# Altium project BeagleBone-AI.PrjPcb (part 1 of 5)
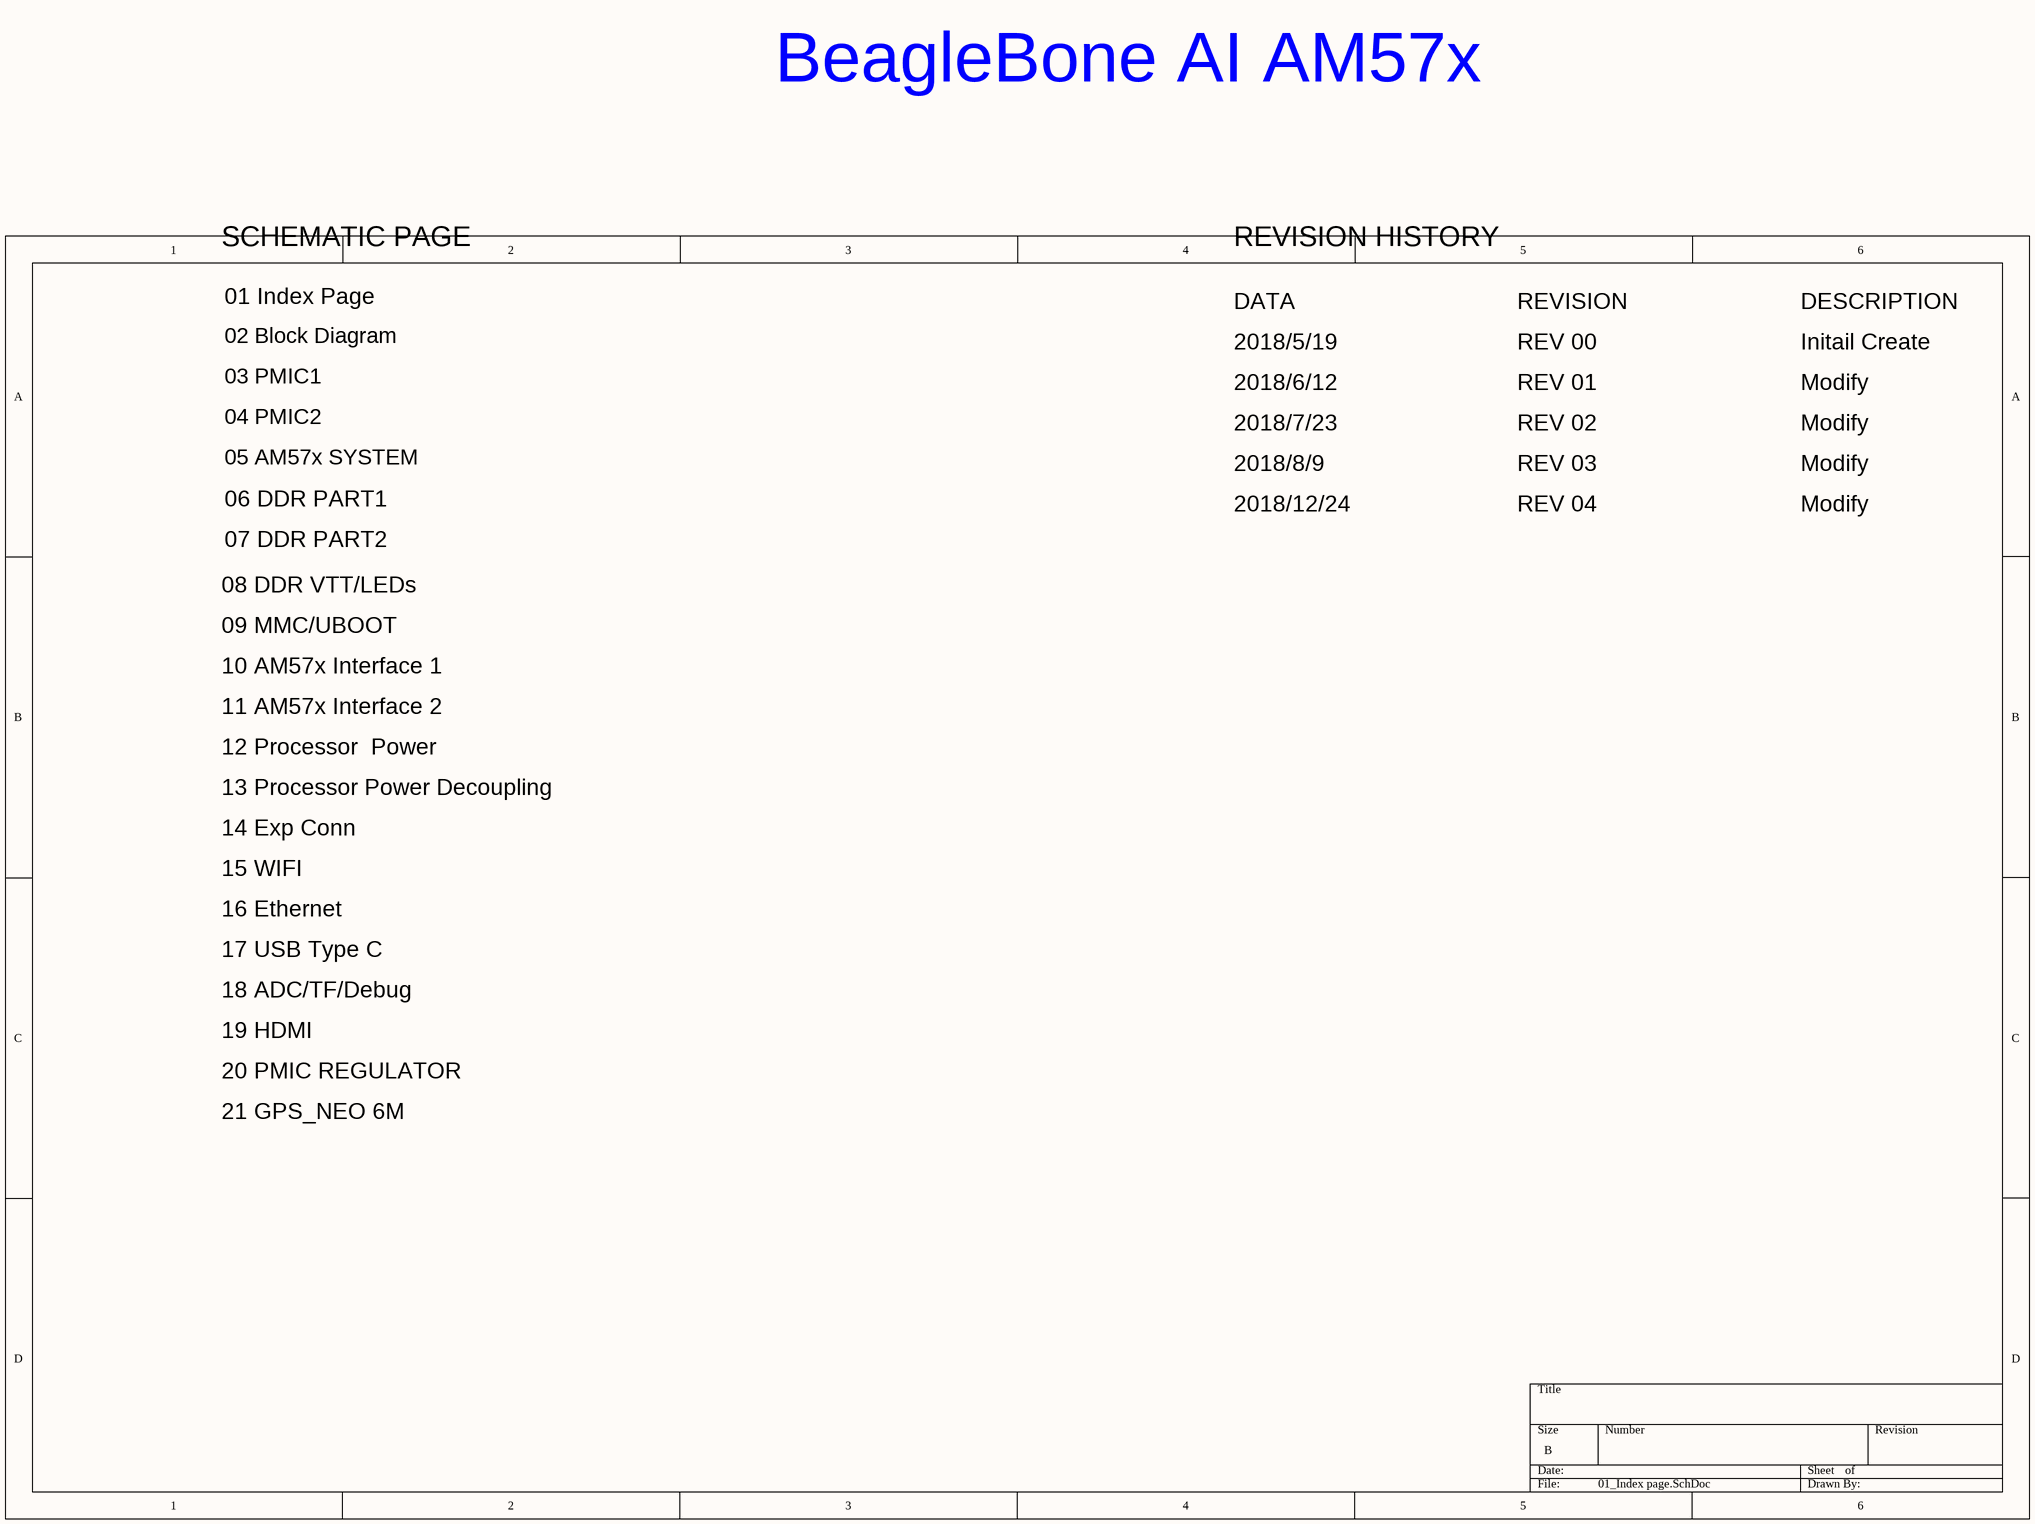
[diagram p0: 01_Index page.SchDoc]
PROJECT NAME: FIT FOR PURPOSE DEVICE; REVISION: V1.0; SIZE: B
22 sheets, 837 parts. Net scope: flat (ports and power ports of the same name join across sheets).
Sheets:
  01_Index page.SchDoc
  02 Block Diagram.SchDoc
  03 PMIC1.SchDoc
  04 PMIC2.SchDoc
  05 AM572x SYSTEM.SchDoc
  06 DDR PART1.SchDoc
  07 DDR PART2.SchDoc
  08 DDR VTT_LEDs.SchDoc
  09 MMC_UBOOT.SchDoc
  10 AM572x Interface 1.SchDoc
  11 AM572x Interface 2.SchDoc
  12 Processor  Power.SchDoc
  13 Processor Power Deco.SchDoc
  14 Exp Conn.SchDoc
  15 WIFI.SchDoc
  16 Ethernet.SchDoc
  17 USB Type C.SchDoc
  18 ADC_TF_Debug.SchDoc
  19 HDMI.SchDoc
  PMIC REGULATORS.SchDoc
  GPS_NEO.SchDoc
  BMS_Circuit.SchDoc

## Sheet 01_Index page.SchDoc: FIT FOR PURPOSE DEVICE
size B; Date: OCTOBER 16, 2020; CompanyName: ICTA; DrawnBy: Researchers; Organization: ICTA; DocumentNumber: 1 OF 21; Revision: V1.0; SheetNumber: 1; SheetTotal: 22; ImagePath: C:\Users\ReaiotV\Desktop

### Notes on the sheet
- BeagleBone AI AM57x
- SCHEMATIC PAGE
- REVISION HISTORY
- 01 Index Page
- DATA
- REVISION
- DESCRIPTION
- 03 PMIC1
- 02 Block Diagram
- 2018/5/19
- 2018/6/12
- REV 00
- REV 01
- Initail Create
- Modify
- 04 PMIC2
- 05 AM57x SYSTEM
- 2018/7/23
- REV 02
- 06 DDR PART1
- 2018/8/9
- 2018/12/24
- REV 03
- REV 04
- 08 DDR VTT/LEDs
- 07 DDR PART2
- 09 MMC/UBOOT
- 10 AM57x Interface 1
- 11 AM57x Interface 2
- 13 Processor Power Decoupling
- 12 Processor  Power
- 14 Exp Conn
- 15 WIFI
- 16 Ethernet
- 17 USB Type C
- 18 ADC/TF/Debug
- 19 HDMI
- 20 PMIC REGULATOR
- 21 GPS_NEO 6M

## Sheet 02 Block Diagram.SchDoc
size 386 x 246 mm

## Sheet 03 PMIC1.SchDoc
size 420 x 297 mm
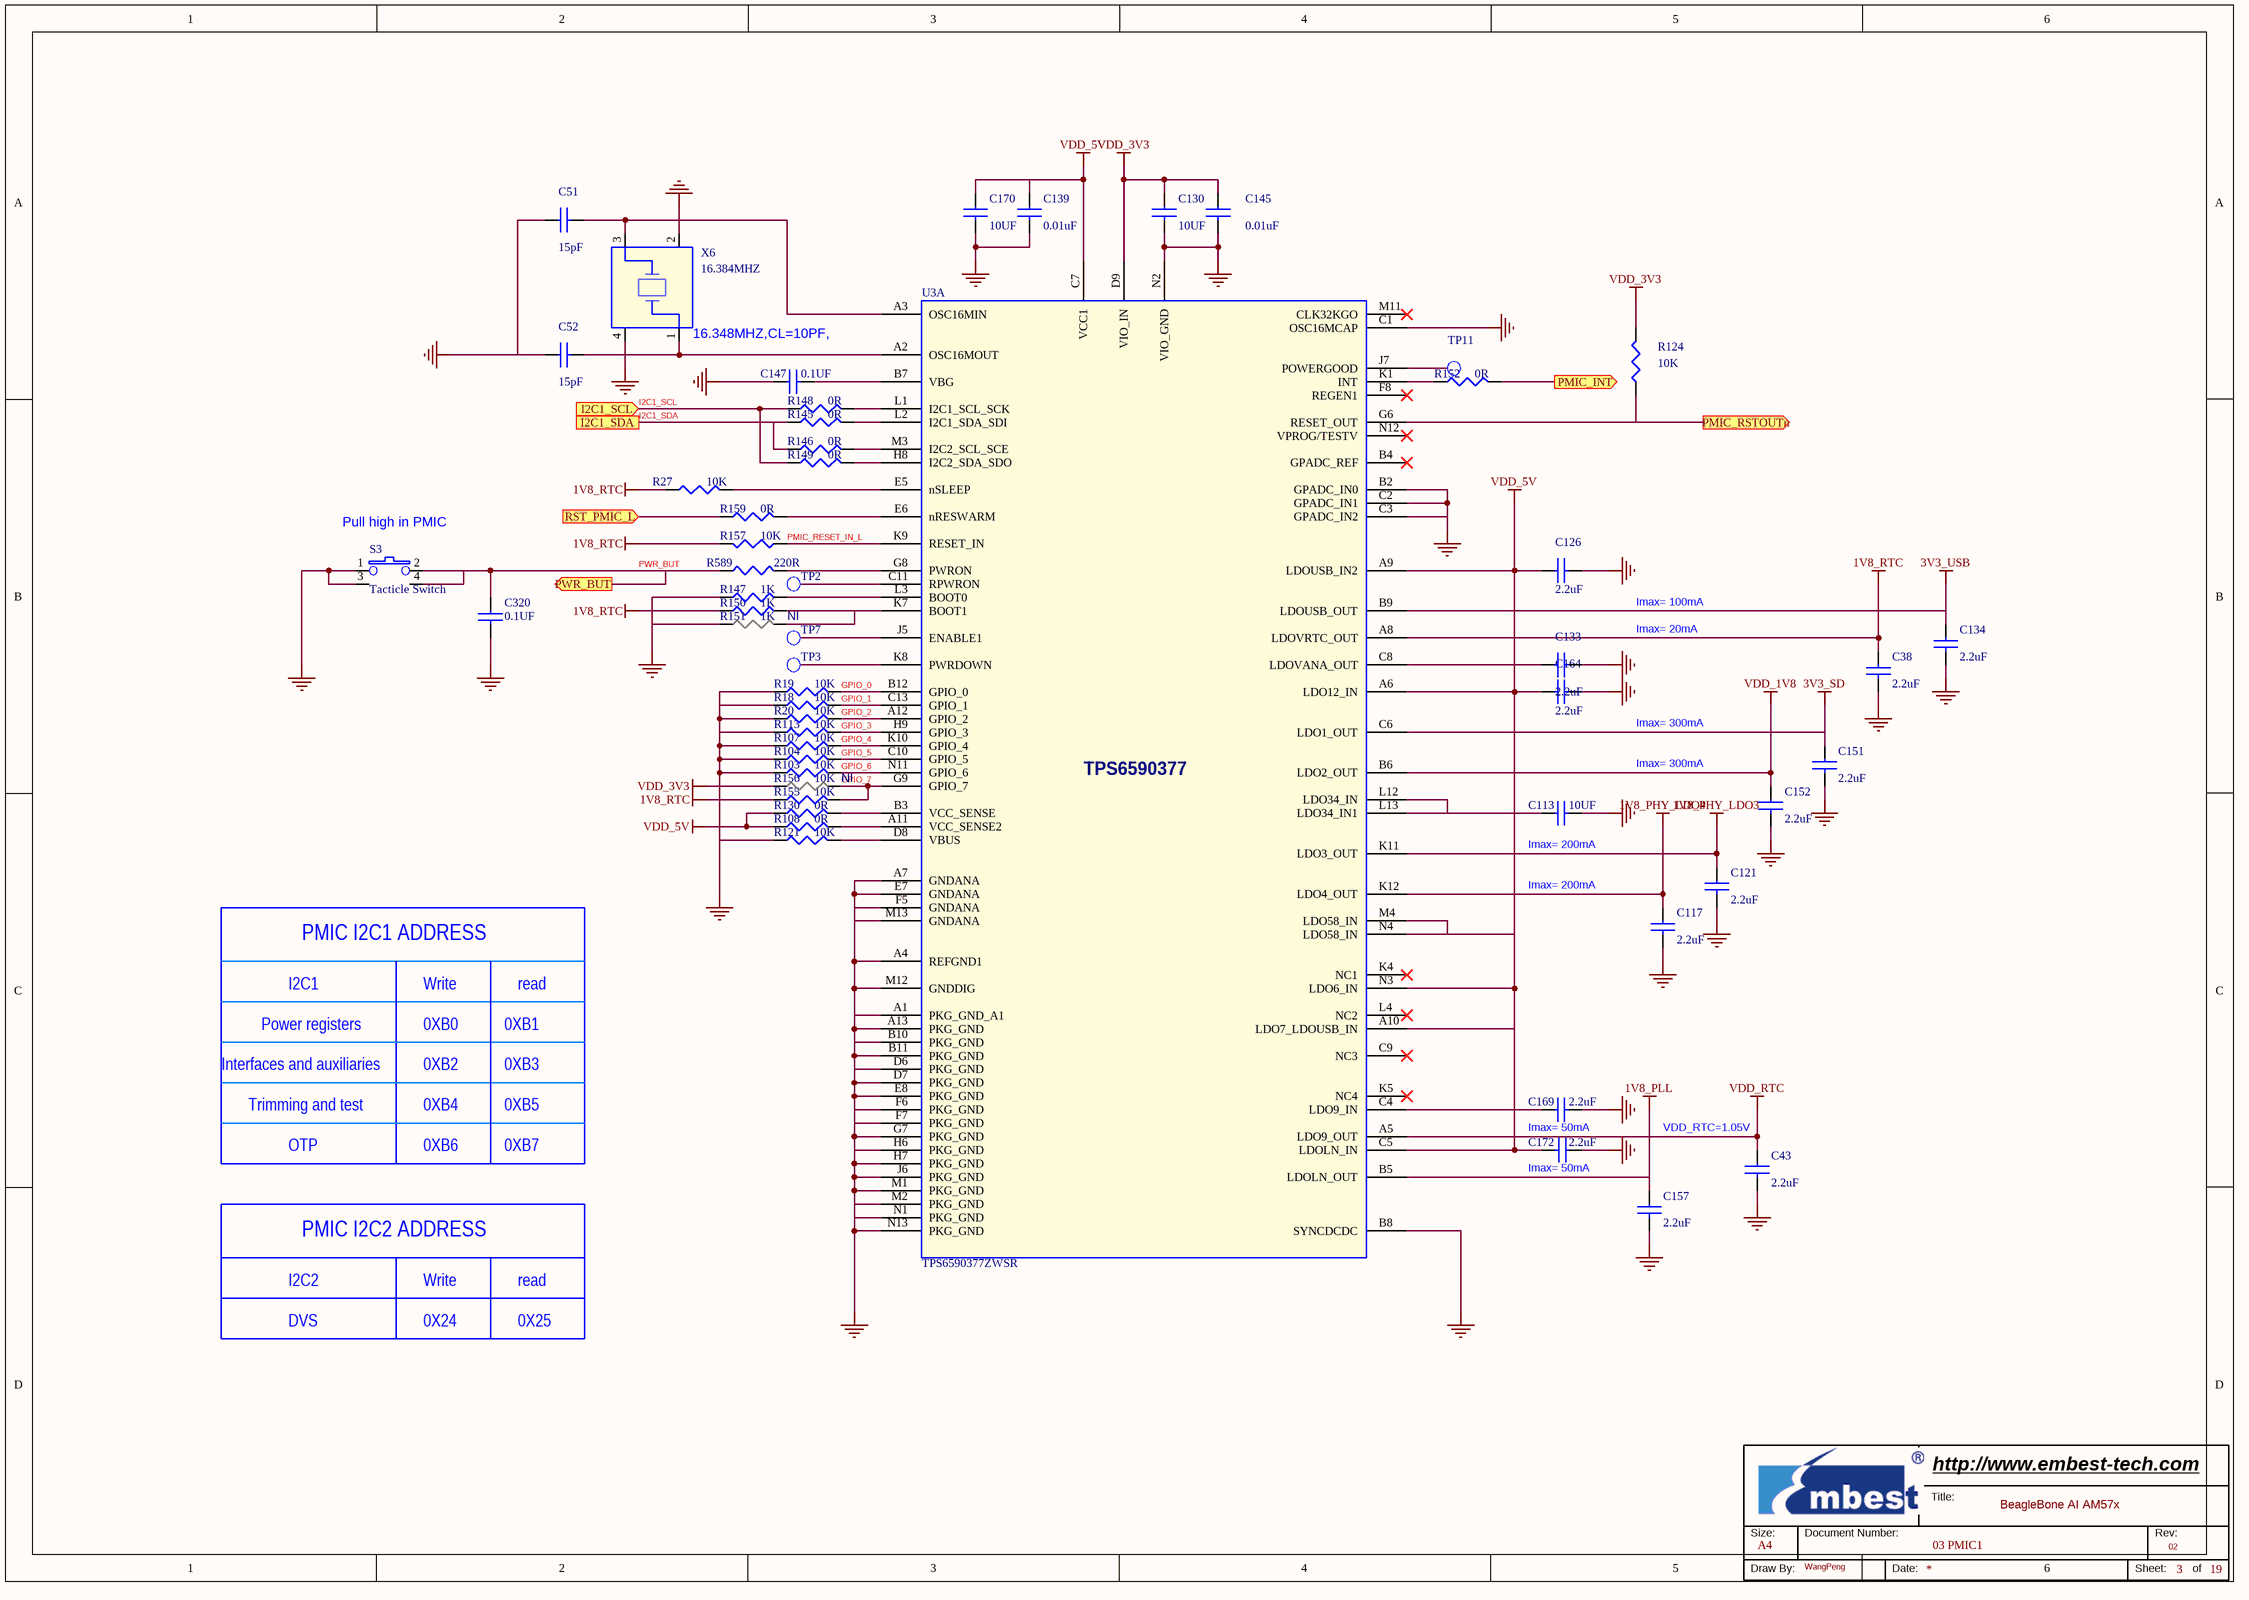
[diagram p1: 03 PMIC1.SchDoc]

### Parts
(Parts that share a designator on the sheet are numbered #1, #2 ... from top to bottom, then left to right.)
*#1  Page Count: 19  Page Number: 3  Page Size: A4  Title: BeagleBone AI AM57x  RevCode: 02  Doc: 03 PMIC1  Drawing: WangPeng  (hidden comment: Embest Title)  (graphical)
C38  2.2uF  [C0402]
C43  2.2uF  [C0402]
C51  15pF  [C0402]
C52  15pF  [C0402]
C113  10UF  [C0603]
C117  2.2uF  [C0402]
C121  2.2uF  [C0402]
C126  2.2uF  [C0603]
C130  10UF  [C0603]
C133  2.2uF  [C0402]
C134  2.2uF  [C0402]
C139  0.01uF  [C0402]
C145  0.01uF  [C0402]
C147  0.1UF  [C0402]
C151  2.2uF  [C0402]
C152  2.2uF  [C0402]
C157  2.2uF  [C0402]
C164  2.2uF  [C0603]
C169  2.2uF  [C0603]
C170  10UF  [C0603]
C172  2.2uF  [C0603]
C320  0.1UF  [C0402]
R18  10K  [R0402]
R19  10K  [R0402]
R20  10K  [R0402]
R27  10K  [R0402]
R103  10K  [R0402]
R104  10K  [R0402]
R107  10K  [R0402]
R108  0R  [R0402]
R113  10K  [R0402]
R121  10K  [R0402]
R124  10K  [R0402]
R130  0R  [R0402]
R145  0R  [R0402]
R146  0R  [R0402]
R147  1K  [R0402]
R148  0R  [R0402]
R149  0R  [R0402]
R150  1K  [R0402]
R151  1K  ASSY: NI  [R0402]
R152  0R  [R0402]
R155  10K  [R0402]
R156  10K  ASSY: NI  [R0402]
R157  10K  [R0402]
R159  0R  [R0402]
R589  220R  [R0402]
S3  Tacticle Switch  [SWS4B46X28]
TP2  NI  [TP1-8040]  (value not drawn)
TP3  NI  [TP1-8040]  (value not drawn)
TP7  NI  [TP1-8040]  (value not drawn)
TP11  NI  [TP1-8040]  (value not drawn)
U3  TPS6590377ZWSR  [bga12x12-169-55m]  (part A of 2)
X6  16.384MHZ  [OSCCC250x200x60-4N]

### Ports
I2C1_SCL (in), I2C1_SDA, PMIC_INT (out), PMIC_RSTOUTn (out), PWR_BUT (out), RST_PMIC_L (in)

### Nets
1V8_PHY_LDO3: C121.1 U3.K11(LDO3_OUT)
1V8_PHY_LDO4: C117.1 U3.K12(LDO4_OUT)
1V8_PLL: C157.1 U3.B5(LDOLN_OUT)
1V8_RTC: C38.1 R27.1 R150.1 R155.1 R157.2 U3.A8(LDOVRTC_OUT)
3V3_SD: C151.1 U3.C6(LDO1_OUT)
3V3_USB: C134.1 U3.B9(LDOUSB_OUT)
GND: C38.2 C43.2 C51.1 C52.1 C113.2 C117.2 C121.2 C126.2 C130.2 C133.2 C134.2 C139.2 C145.2 C147.1 C151.2 C152.2 C157.2 C164.2 C169.2 C170.2 C172.1 C320.2 R18.1 R19.1 R20.1 R103.1 R104.1 R107.1 R113.1 R121.1 R147.1 R151.1 S3.1 S3.3 U3.A1(PKG_GND_A1) U3.A4(REFGND1) U3.A7(GNDANA) U3.A13(PKG_GND) U3.B2(GPADC_IN0) U3.B8(SYNCDCDC) U3.B10(PKG_GND) U3.B11(PKG_GND) U3.C1(OSC16MCAP) U3.C2(GPADC_IN1) U3.C3(GPADC_IN2) U3.D6(PKG_GND) U3.D7(PKG_GND) U3.E7(GNDANA) U3.E8(PKG_GND) U3.F5(GNDANA) U3.F6(PKG_GND) U3.F7(PKG_GND) U3.G7(PKG_GND) U3.H6(PKG_GND) U3.H7(PKG_GND) U3.J6(PKG_GND) U3.M1(PKG_GND) U3.M2(PKG_GND) U3.M12(GNDDIG) U3.M13(GNDANA) U3.N1(PKG_GND) U3.N2(VIO_GND) U3.N13(PKG_GND) X6.2 X6.4  [project net DDR1_RST]
VDD_1V8: C152.1 U3.B6(LDO2_OUT)
VDD_3V3: C130.1 C145.1 R124.2 R156.1 U3.D9(VIO_IN)
VDD_5V: C126.1 C139.1 C164.1 C170.1 C172.2 R108.1 R130.1 U3.A6(LDO12_IN) U3.A9(LDOUSB_IN2) U3.A10(LDO7_LDOUSB_IN) U3.C5(LDOLN_IN) U3.C7(VCC1) U3.M4(LDO58_IN) U3.N3(LDO6_IN) U3.N4(LDO58_IN)
VDD_RTC: C43.1 U3.A5(LDO9_OUT)
GPIO_0: R19.2 U3.B12(GPIO_0)
GPIO_1: R18.2 U3.C13(GPIO_1)
GPIO_2: R20.2 U3.A12(GPIO_2)
GPIO_3: R113.2 U3.H9(GPIO_3)
GPIO_4: R107.2 U3.K10(GPIO_4)
GPIO_5: R104.2 U3.C10(GPIO_5)
GPIO_6: R103.2 U3.N11(GPIO_6)
GPIO_7: R155.2 R156.2 U3.G9(GPIO_7)
I2C1_SCL: R148.1 R149.1 ; port I2C1_SCL
I2C1_SDA: R145.1 R146.1 ; port I2C1_SDA
PMIC_RESET_IN_L: R157.1 U3.K9(RESET_IN)
PWR_BUT: C320.1 R589.1 S3.2 S3.4 ; port PWR_BUT
NetC51_2: C51.2 U3.A3(OSC16MIN) X6.3
NetC52_2: C52.2 U3.A2(OSC16MOUT) X6.1
NetC113_1: C113.1 U3.L12(LDO34_IN) U3.L13(LDO34_IN1)
NetC133_1: C133.1 U3.C8(LDOVANA_OUT)
NetC147_2: C147.2 U3.B7(VBG)
NetC169_1: C169.1 U3.C4(LDO9_IN)
NetR27_2: R27.2 U3.E5(nSLEEP)
NetR57_2: R159.1 ; port RST_PMIC_L
NetR108_2: R108.2 U3.A11(VCC_SENSE2)
NetR121_2: R121.2 U3.D8(VBUS)
NetR124_1: R124.1 U3.G6(RESET_OUT) ; port PMIC_RSTOUTn
NetR130_2: R130.2 U3.B3(VCC_SENSE)
NetR145_2: R145.2 U3.L2(I2C1_SDA_SDI)
NetR146_2: R146.2 U3.M3(I2C2_SCL_SCE)
NetR147_2: R147.2 U3.L3(BOOT0)
NetR148_2: R148.2 U3.L1(I2C1_SCL_SCK)
NetR149_2: R149.2 U3.H8(I2C2_SDA_SDO)
NetR150_2: R150.2 R151.2 U3.K7(BOOT1)
NetR152_1: R152.1 U3.K1(INT)
NetR152_2: R152.2 ; port PMIC_INT
NetR159_2: R159.2 U3.E6(nRESWARM)
NetR589_2: R589.2 U3.G8(PWRON)
NetTP2_1: TP2.1(TP) U3.C11(RPWRON)
NetTP3_1: TP3.1(TP) U3.K8(PWRDOWN)
NetTP7_1: TP7.1(TP) U3.J5(ENABLE1)
NetTP11_1: TP11.1(TP) U3.J7(POWERGOOD)

Not connected (* = marked no-connect by the designer): U3 B4(GPADC_REF)* C9(NC3)* F8(REGEN1)* K4(NC1)* K5(NC4)* L4(NC2)* M11(CLK32KGO)* N12(VPROG/TESTV)*

### Notes on the sheet
- (near X6) 16.348MHZ,CL=10PF,
- (near S3) Pull high in PMIC
- Imax= 100mA
- Imax= 20mA
- Imax= 300mA
- (near C113) Imax= 200mA
- Imax= 200mA
- I2C1
- PMIC I2C1 ADDRESS
- Write
- read
- Interfaces and auxiliaries
- Power registers
- 0XB0
- 0XB2
- 0XB1
- 0XB3
- Trimming and test
- 0XB4
- 0XB5
- Imax= 50mA
- (near C43) VDD_RTC=1.05V
- OTP
- 0XB6
- 0XB7
- (near C172) Imax= 50mA
- PMIC I2C2 ADDRESS
- I2C2
- DVS
- 0X24
- 0X25
- (in symbol Embest Title) Title:; Size:; Document Number:; Rev:; Draw By:; Date:; Sheet:; of
- (in symbol TPS659037, part A) TPS6590377

### Library data of the parts
C38 C117 C121 C134 C151 = C: CAP,2.2UF,+/-20%,X5R,6.3V,SMD0402; Manufacturer: Murata; Manufacturer Part Number: GRM155R60J225ME15D; Embest PN: 1004001100059; Part Type: Ceramic Capacitor
C43 C133 C152 C157 = C: CAP,2.2UF,+/-20%,X5R,6.3V,SMD0402; Manufacturer Part Number: GRM155R60J225ME15D; Manufacturer: Murata; Embest PN: 1004001100059; Part Type: Ceramic Capacitor
C51 = C: CAP,15pF,+/-2%,C0G,50V,SMD0402; Manufacturer: Murata; Manufacturer Part Number: GRM1555C1H150GA01D; Embest PN: 1004001100319; Part Type: Ceramic Capacitor; Datasheet: Y:\ÐÂK3ÏµÍ³ÎïÁÏdatasheet\[1003_1004]capacitor-resistor µçÈÝ¡¢µç×è\1004001100319 GRM1555C1H150GA01DMurata.pdf
C52 = C: CAP,15pF,+/-2%,C0G,50V,SMD0402; Manufacturer Part Number: GRM1555C1H150GA01D; Manufacturer: Murata; Embest PN: 1004001100319; Datasheet: Y:\ÐÂK3ÏµÍ³ÎïÁÏdatasheet\[1003_1004]capacitor-resistor µçÈÝ¡¢µç×è\1004001100319 GRM1555C1H150GA01DMurata.pdf; Part Type: Ceramic Capacitor
C113 = C: CAP,10UF,+/-10%,X5R,10V,SMD0603; Manufacturer: Murata; Manufacturer Part Number: GRM188R61A106KE69D; Embest PN: 1004001100129; Part Type: Ceramic Capacitor; Datasheet: Y:\ÐÂK3ÏµÍ³ÎïÁÏdatasheet\[1003_1004]capacitor-resistor µçÈÝ¡¢µç×è\1004001100129T2 C1608X5R1A106M.pdf
C126 C164 = C: CAP,2.2UF,+/-10%,X5R,16V,SMD0603; Manufacturer Part Number: GRM188R61C225KE15D; Manufacturer: Murata; Embest PN: 1004001100124; Part Type: Ceramic Capacitor
C130 C170 = C: CAP,10UF,+/-10%,X5R,10V,SMD0603; Manufacturer Part Number: GRM188R61A106KE69D; Manufacturer: Murata; Embest PN: 1004001100129; Datasheet: Y:\ÐÂK3ÏµÍ³ÎïÁÏdatasheet\[1003_1004]capacitor-resistor µçÈÝ¡¢µç×è\1004001100129T2 C1608X5R1A106M.pdf; Part Type: Ceramic Capacitor
C139 C145 = C: CAP,10NF,+/-10%,X7R,16V,SMD0402; Manufacturer Part Number: GRM155R71C103KA01D; Manufacturer: MURATA; Embest PN: 1004001100039; Part Type: Ceramic Capacitor
C147 = C: CAP,100NF,+/-10%,X7R,16V,SMD0402; Manufacturer: Murata; Manufacturer Part Number: GRM155R71C104KA88D; Embest PN: 1004001100047; Part Type: Ceramic Capacitor; Datasheet: Y:\ÐÂK3ÏµÍ³ÎïÁÏdatasheet\[1003_1004]capacitor-resistor µçÈÝ¡¢µç×è\1004001100047-GRM155R71C104KA88D.pdf
C169 C172 = C: CAP,2.2UF,+/-10%,X5R,16V,SMD0603; Manufacturer: Murata; Manufacturer Part Number: GRM188R61C225KE15D; Embest PN: 1004001100124; Part Type: Ceramic Capacitor
C320 = C: CAP,100NF,+/-10%,X7R,16V,SMD0402; Manufacturer Part Number: GRM155R71C104KA88D; Manufacturer: Murata; Embest PN: 1004001100047; Datasheet: Y:\ÐÂK3ÏµÍ³ÎïÁÏdatasheet\[1003_1004]capacitor-resistor µçÈÝ¡¢µç×è\1004001100047-GRM155R71C104KA88D.pdf; Part Type: Ceramic Capacitor
R18 R19 R27 R103 R104 R107 R113 = R: RES,10K,+/-5%,1/16W,SMD0402; Manufacturer Part Number: RC0402JR-0710KL; Manufacturer: YAGEO; Embest PN: 1003001100072; Part Type: Thick film Resistor
R20 = R: RES,10K,+/-5%,1/16W,SMD0402; Manufacturer Part Number: RC0402JR-0710KL; Manufacturer: YAGEO; SIGNAL_MODEL: RES_22_1/16W_5%_0402_402_22_5%_22_5%; Embest PN: 1003001100072; Part Type: Thick film Resistor
R108 R130 R148 R152 = R: RES,0R,+/-5%,1/16W,SMD0402; Manufacturer: YAGEO; Manufacturer Part Number: RC0402JR-070RL; Embest PN: 1003001100001; Part Type: Thick film Resistor
R121 R124 R155-R157 = R: RES,10K,+/-5%,1/16W,SMD0402; Manufacturer: YAGEO; Manufacturer Part Number: RC0402JR-0710KL; Embest PN: 1003001100072; Part Type: Thick film Resistor
R145 R146 R149 R159 = R: RES,0R,+/-5%,1/16W,SMD0402; Manufacturer Part Number: RC0402JR-070RL; Manufacturer: YAGEO; Embest PN: 1003001100001; Part Type: Thick film Resistor
R147 R151 = R: RES,1K,+/-5%,1/16W,SMD0402; Manufacturer Part Number: RC0402JR-071KL; Manufacturer: YAGEO; Embest PN: 1003001100035; Part Type: Thick film Resistor
R150 = R: RES,1K,+/-5%,1/16W,SMD0402; Manufacturer: YAGEO; Manufacturer Part Number: RC0402JR-071KL; Embest PN: 1003001100035; Part Type: Thick film Resistor
R589 = R: RES,220R,+/-5%,1/16W,SMD0402; Manufacturer: YAGEO; Manufacturer Part Number: RC0402JR-07220RL; Embest PN: 1003001100025; Part Type: Thick film Resistor
S3 = PSW4: Switch,Tactile,300gf+/-50gf,black housing,black plunger,4.6*2.8*1.9MM,SMD; Manufacturer Part Number: KMR231GLFS; Manufacturer: C&K; Embest PN: 1010001100030; Datasheet: Y:\ÐÂK3ÏµÍ³ÎïÁÏdatasheet\[1010]switches ¿ª¹Ø°´¼ü\1010001100030_KMR231GLFS_C&K.pdf; Part Type: TACT
TP2 TP3 TP7 TP11 = TEST POINT: Test point,DIA 30mil; PCB Footprint: TP30; Embest PN: PN008; Part Type: TP
U3 = TPS659037: IC TPS659037 Power Management Unit (PMU) for Processor NFBGA-169 SMD; Manufacturer: TI; Embest PN: 1002004100230; Part Type: Power Management; Manufacturer Part Number: TPS6590377ZWSR; Status: AM5728; Datasheet: Y:\ÐÂK3ÏµÍ³ÎïÁÏdatasheet\[1002]IC ¼¯³ÉµçÂ·\1002004100230 [TPS6590377ZWSR] tps659037.pdf
X6 = X4: Crystal,5ZAA16384102TFA5Q3,16.384MHz,+/-20PPM,10PF,2520-4 pads,SMD; Manufacturer: INTERQUIP; Embest PN: 1008002100252; Rating: 20PPM; Part Type: Crystal; Manufacturer Part Number: 5ZAA16384102TFA5Q3; Status: Hamster AM572x; Datasheet: Y:\ÐÂK3ÏµÍ³ÎïÁÏdatasheet\[1008]crystal ¾§Ìå\1008002100252 5ZAA16384102TFA5Q3¹æ¸ñÊé.pdf
*#1 = Embest Title: Page Create Date: May 29, 2006; WebSite: http://www.embest-tech.com; Company: Embest; Page Modify Date: *

## Sheet 04 PMIC2.SchDoc
size 420 x 297 mm
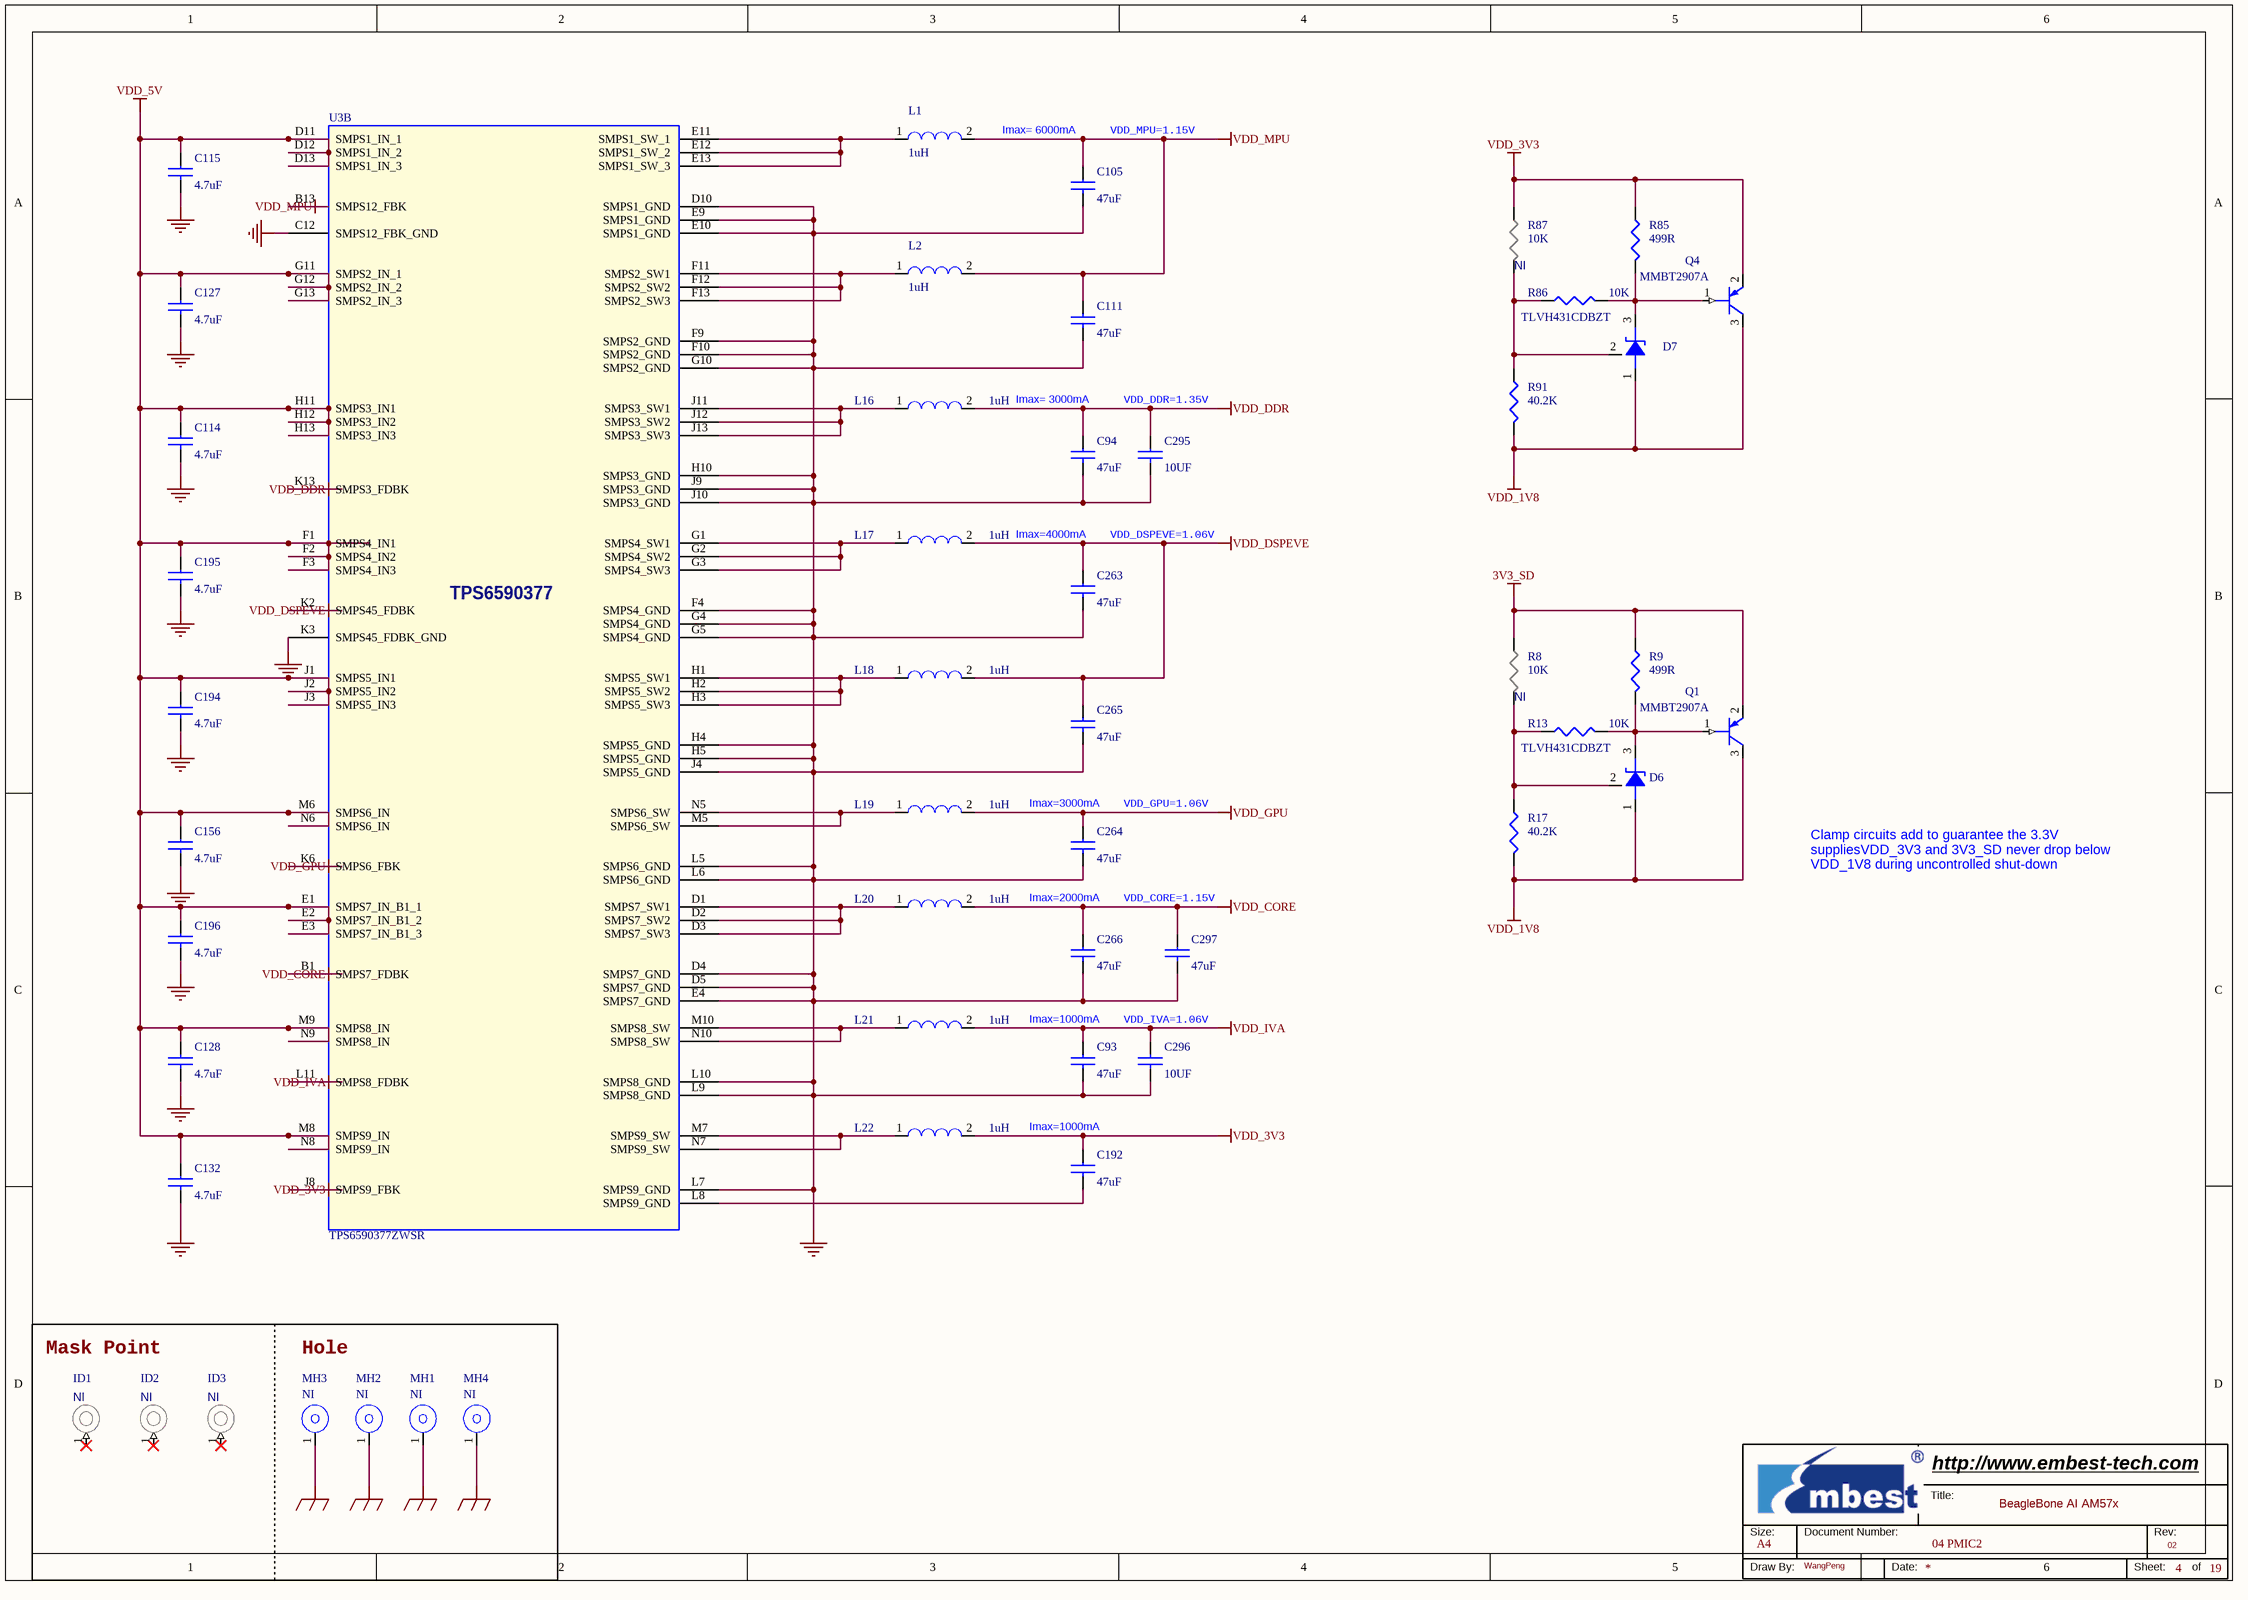
[diagram p2: 04 PMIC2.SchDoc]

### Parts
(Parts that share a designator on the sheet are numbered #1, #2 ... from top to bottom, then left to right.)
*#2  Page Count: 19  Page Number: 4  Page Size: A4  Title: BeagleBone AI AM57x  RevCode: 02  Doc: 04 PMIC2  Drawing: WangPeng  (hidden comment: Embest Title)  (graphical)
C93  47uF  [C0805]
C94  47uF  [C0805]
C105  47uF  [C0805]
C111  47uF  [C0805]
C114  4.7uF  [C0603]
C115  4.7uF  [C0603]
C127  4.7uF  [C0603]
C128  4.7uF  [C0603]
C132  4.7uF  [C0603]
C156  4.7uF  [C0603]
C192  47uF  [C0805]
C194  4.7uF  [C0603]
C195  4.7uF  [C0603]
C196  4.7uF  [C0603]
C263  47uF  [C0805]
C264  47uF  [C0805]
C265  47uF  [C0805]
C266  47uF  [C0805]
C295  10UF  [C0603]
C296  10UF  [C0402]
C297  47uF  [C0805]
D6  TLVH431CDBZT  [sot95p240x120-3n]
D7  TLVH431CDBZT  [sot95p240x120-3n]
ID1  NI  [FD40]
ID2  NI  [FD40]
ID3  NI  [FD40]
L1  1uH  [L40X40_B]
L2  1uH  [L40X40_B]
L16  1uH  [INDPW250X200X105N]
L17  1uH  [INDPW250X200X105N]
L18  1uH  [INDPW250X200X105N]
L19  1uH  [INDPW250X200X105N]
L20  1uH  [INDPW250X200X105N]
L21  1uH  [INDPW250X200X105N]
L22  1uH  [INDPW250X200X105N]
MH1  NI  [MTGH200C125D_PL]
MH2  NI  [MTGH200C125D_PL]
MH3  NI  [MTGH200C125D_PL]
MH4  NI  [MTGH200C125D_PL]
Q1  MMBT2907A  [SOT23_123]
Q4  MMBT2907A  [SOT23_123]
R8  10K  ASSY: NI  [R0402]
R9  499R  [R0402]
R13  10K  [R0402]
R17  40.2K  [R0402]
R85  499R  [R0402]
R86  10K  [R0402]
R87  10K  ASSY: NI  [R0402]
R91  40.2K  [R0402]
U3  TPS6590377ZWSR  [bga12x12-169-55m]  (part B of 2)

### Nets
3V3_SD: Q1.2(E) R8.1 R9.1
GND: C93.2 C94.2 C105.2 C111.2 C114.2 C115.2 C127.2 C128.2 C132.2 C156.2 C194.2 C195.2 C196.2 C263.2 C264.2 C265.2 C266.2 C295.2 C296.2 C297.2 U3.C12(SMPS12_FBK_GND) U3.D4(SMPS7_GND) U3.D5(SMPS7_GND) U3.D10(SMPS1_GND) U3.E4(SMPS7_GND) U3.E9(SMPS1_GND) U3.E10(SMPS1_GND) U3.F4(SMPS4_GND) U3.F9(SMPS2_GND) U3.F10(SMPS2_GND) U3.G4(SMPS4_GND) U3.G5(SMPS4_GND) U3.G10(SMPS2_GND) U3.H4(SMPS5_GND) U3.H5(SMPS5_GND) U3.H10(SMPS3_GND) U3.J4(SMPS5_GND) U3.J9(SMPS3_GND) U3.J10(SMPS3_GND) U3.K3(SMPS45_FDBK_GND) U3.L5(SMPS6_GND) U3.L6(SMPS6_GND) U3.L7(SMPS9_GND) U3.L9(SMPS8_GND) U3.L10(SMPS8_GND)  [project net DDR1_RST]
GND_EARTH: MH1.1 MH2.1 MH3.1 MH4.1
VDD_1V8: D6.1(A) D7.1(A) Q1.3(C) Q4.3(C) R17.2 R91.2
VDD_3V3: C192.1 L22.2 Q4.2(E) R85.1 R87.1 U3.J8(SMPS9_FBK)
VDD_5V: C114.1 C115.1 C127.1 C128.1 C132.1 C156.1 C194.1 C195.1 C196.1 U3.D11(SMPS1_IN_1) U3.D12(SMPS1_IN_2) U3.D13(SMPS1_IN_3) U3.E1(SMPS7_IN_B1_1) U3.E2(SMPS7_IN_B1_2) U3.E3(SMPS7_IN_B1_3) U3.F1(SMPS4_IN1) U3.F2(SMPS4_IN2) U3.F3(SMPS4_IN3) U3.G11(SMPS2_IN_1) U3.G12(SMPS2_IN_2) U3.G13(SMPS2_IN_3) U3.H11(SMPS3_IN1) U3.H12(SMPS3_IN2) U3.H13(SMPS3_IN3) U3.J1(SMPS5_IN1) U3.J2(SMPS5_IN2) U3.J3(SMPS5_IN3) U3.M6(SMPS6_IN) U3.M8(SMPS9_IN) U3.M9(SMPS8_IN) U3.N6(SMPS6_IN) U3.N8(SMPS9_IN) U3.N9(SMPS8_IN)
VDD_CORE: C266.1 C297.1 L20.2 U3.B1(SMPS7_FDBK)
VDD_DDR: C94.1 C295.1 L16.2 U3.K13(SMPS3_FDBK)
VDD_DSPEVE: C263.1 C265.1 L17.2 L18.2 U3.K2(SMPS45_FDBK)
VDD_GPU: C264.1 L19.2 U3.K6(SMPS6_FBK)
VDD_IVA: C93.1 C296.1 L21.2 U3.L11(SMPS8_FDBK)
VDD_MPU: C105.1 C111.1 L1.2 L2.2 U3.B13(SMPS12_FBK)
NetC192_2: C192.2 U3.L8(SMPS9_GND)
NetD6_2: D6.2(NC) R8.2 R13.1 R17.1
NetD6_3: D6.3(K) Q1.1(B) R9.2 R13.2
NetD7_2: D7.2(NC) R86.1 R87.2 R91.1
NetD7_3: D7.3(K) Q4.1(B) R85.2 R86.2
NetL1_1: L1.1 U3.E11(SMPS1_SW_1) U3.E12(SMPS1_SW_2) U3.E13(SMPS1_SW_3)
NetL2_1: L2.1 U3.F11(SMPS2_SW1) U3.F12(SMPS2_SW2) U3.F13(SMPS2_SW3)
NetL16_1: L16.1 U3.J11(SMPS3_SW1) U3.J12(SMPS3_SW2) U3.J13(SMPS3_SW3)
NetL17_1: L17.1 U3.G1(SMPS4_SW1) U3.G2(SMPS4_SW2) U3.G3(SMPS4_SW3)
NetL18_1: L18.1 U3.H1(SMPS5_SW1) U3.H2(SMPS5_SW2) U3.H3(SMPS5_SW3)
NetL19_1: L19.1 U3.M5(SMPS6_SW) U3.N5(SMPS6_SW)
NetL20_1: L20.1 U3.D1(SMPS7_SW1) U3.D2(SMPS7_SW2) U3.D3(SMPS7_SW3)
NetL21_1: L21.1 U3.M10(SMPS8_SW) U3.N10(SMPS8_SW)
NetL22_1: L22.1 U3.M7(SMPS9_SW) U3.N7(SMPS9_SW)

Not connected (* = marked no-connect by the designer): ID1 1*; ID2 1*; ID3 1*

### Notes on the sheet
- Imax= 6000mA
- (near C105) VDD_MPU=1.15V
- Imax= 3000mA
- VDD_DDR=1.35V
- Imax=4000mA
- VDD_DSPEVE=1.06V
- (near C264) Imax=3000mA
- (near C264) VDD_GPU=1.06V
- Clamp circuits add to guarantee the 3.3V
  suppliesVDD_3V3 and 3V3_SD never drop below
  VDD_1V8 during uncontrolled shut-down
- Imax=2000mA
- VDD_CORE=1.15V
- (near C93) Imax=1000mA
- (near C296) VDD_IVA=1.06V
- (near C192) Imax=1000mA
- Mask Point
- Hole
- (in symbol Embest Title) Title:; Size:; Document Number:; Rev:; Draw By:; Date:; Sheet:; of
- (in symbol TPS659037, part B) TPS6590377

### Library data of the parts
C93 C94 C105 C111 C192 C263-C266 C297 = C: CAP,47UF,+/-20%,X5R,6.3V,SMD0805; Manufacturer Part Number: GRM21BR60J476ME15L; Manufacturer: MURATA; Embest PN: 1004001100164; Part Type: Ceramic Capacitor
C114 = C: CAP,4.7UF,+/-10%,X5R,16V,SMD0603; Manufacturer Part Number: GRM188R61C475KAAJD; Manufacturer: Murata; Embest PN: 1004001100127; SIGNAL_MODEL: CAP_0.1UF_X7R_16V_10%_0402__402_0.1uf_16V; Datasheet: Y:\ÐÂK3ÏµÍ³ÎïÁÏdatasheet\[1003_1004]capacitor-resistor µçÈÝ¡¢µç×è\1004001100127 GRM188R61C475KAAJD murata.pdf; Part Type: Ceramic Capacitor
C115 C132 = C: CAP,4.7UF,+/-10%,X5R,16V,SMD0603; Manufacturer Part Number: GRM188R61C475KAAJD; Manufacturer: Murata; Embest PN: 1004001100127; Datasheet: Y:\ÐÂK3ÏµÍ³ÎïÁÏdatasheet\[1003_1004]capacitor-resistor µçÈÝ¡¢µç×è\1004001100127 GRM188R61C475KAAJD murata.pdf; Part Type: Ceramic Capacitor
C127 C128 C156 C194-C196 = C: CAP,4.7UF,+/-10%,X5R,16V,SMD0603; Manufacturer: Murata; Manufacturer Part Number: GRM188R61C475KAAJD; Embest PN: 1004001100127; Part Type: Ceramic Capacitor; Datasheet: Y:\ÐÂK3ÏµÍ³ÎïÁÏdatasheet\[1003_1004]capacitor-resistor µçÈÝ¡¢µç×è\1004001100127 GRM188R61C475KAAJD murata.pdf
C295 = C: as C113 on sheet 03 PMIC1; Part Type: Ceramic Capacitor; Datasheet: Y:\ÐÂK3ÏµÍ³ÎïÁÏdatasheet\[1003_1004]capacitor-resistor µçÈÝ¡¢µç×è\1004001100129T2 C1608X5R1A106M.pdf
C296 = C: CAP,10UF,+/-20%,X5R,6.3V,SMD0402; Manufacturer Part Number: CC0402MRX5R5BB106; Manufacturer: Yageo; Rating: <Rating>; Embest PN: 1004001100345; PCB Footprint: C0402; Part Type: Ceramic Capacitor
D6 D7 = DIODE ZENER_3: IC,Low-Voltage Adjustable Precision Shunt Regulators; Manufacturer: TI; Embest PN: 1002020100318; Status: AM5728; Manufacturer Part Number: TLVH431CDBZT; Part Type: Specific IC
ID1-ID3 = MARK POINT: MARK  point,DIA 40mil; Embest PN: PN002; ASSY: NI; Part Type: MARK
L1 = L: Power Inductor,Magnetic shielded,1uH,idc4.5A,27mohm,4.3x4.0x2.0mm,20%,SMD,TR; Manufacturer Part Number: SP04O203M1U; Manufacturer: GAUSSTEK; Embest PN: 1005004100077; Datasheet: Y:\ÐÂK3ÏµÍ³ÎïÁÏdatasheet\[1005]beads-inductors ´ÅÖé¡¢µç¸Ð\1005004100077 S-Ó¢ÝíÌØSP04O203M1U.pdf; Part Type: Power Inductor
L2 = L: Power Inductor,Magnetic shielded,1uH,idc4.5A,27mohm,4.3x4.0x2.0mm,20%,SMD,TR; Manufacturer: GAUSSTEK; Manufacturer Part Number: SP04O203M1U; Embest PN: 1005004100077; Part Type: Power Inductor; Datasheet: Y:\ÐÂK3ÏµÍ³ÎïÁÏdatasheet\[1005]beads-inductors ´ÅÖé¡¢µç¸Ð\1005004100077 S-Ó¢ÝíÌØSP04O203M1U.pdf
L16 L18 L20 L22 = L: SMD Power Inductors 1uH +/-20%;-25 ¡ãC to +125 ¡ãC SATURATION CURRENT 3.1A;DCR 85m¦¸£¬Size:2.5*2.0*1.05mm; Manufacturer: Gausstek; Manufacturer Part Number: DI20A102M1U; Embest PN: 1005001100194; Part Type: Inductor; Status: Hamster AM572x; Datasheet: Y:\ÐÂK3ÏµÍ³ÎïÁÏdatasheet\[1005]beads-inductors ´ÅÖé¡¢µç¸Ð\1005001100194 DI20A102M1U.pdf
L17 L19 L21 = L: SMD Power Inductors 1uH +/-20%;-25 ¡ãC to +125 ¡ãC SATURATION CURRENT 3.1A;DCR 85m¦¸£¬Size:2.5*2.0*1.05mm; Manufacturer Part Number: DI20A102M1U; Manufacturer: Gausstek; Embest PN: 1005001100194; Datasheet: Y:\ÐÂK3ÏµÍ³ÎïÁÏdatasheet\[1005]beads-inductors ´ÅÖé¡¢µç¸Ð\1005001100194 DI20A102M1U.pdf; Status: Hamster AM572x; Part Type: Inductor
MH1-MH4 = METALLIC HOLE: Plated hole,Circle,DAI 4.445MM ,VIA 3.175MM; Embest PN: PN094; Part Type: HOLE; Status: BeagleBone AI
Q1 Q4 = PNP: Transistor,PNP,MMBT2907A-7-F,60V,600MA,SOT-23,SMD; Manufacturer: Diodes; Embest PN: 1006012100001; Part Type: Transistor; Manufacturer Part Number: MMBT2907A-7-F; Datasheet: Y:\ÐÂK3ÏµÍ³ÎïÁÏdatasheet\[1006002~013]diodes-transistors ¶þÈý¼«¹Ü\1006012100001 Diodes MMBT2907A-7-F.pdf
R8 R13 R86 R87 = R: RES,10K,+/-1%,1/16W,SMD0402; Manufacturer Part Number: RC0402FR-0710KL; Manufacturer: YAGEO; Embest PN: 1003001100071; Part Type: Thick film Resistor
R9 R85 = R: RES,499R,+/-1%,1/16W,SMD0402; Manufacturer: YAGEO; Manufacturer Part Number: RC0402FR-07499RL; Embest PN: 1003001100576; Part Type: Thick film Resistor
R17 R91 = R: RES,40K2,+/-1%,1/16W,SMD0402; Manufacturer: YAGEO; Manufacturer Part Number: RC0402FR-0740K2L; Embest PN: 1003001100099; Part Type: Thick film Resistor
U3 = TPS659037: as U3 on sheet 03 PMIC1; Part Type: Power Management; Manufacturer Part Number: TPS6590377ZWSR; Status: AM5728; Datasheet: Y:\ÐÂK3ÏµÍ³ÎïÁÏdatasheet\[1002]IC ¼¯³ÉµçÂ·\1002004100230 [TPS6590377ZWSR] tps659037.pdf
*#2 = Embest Title: Page Create Date: May 29, 2006; WebSite: http://www.embest-tech.com; Company: Embest; Page Modify Date: *

## Sheet 05 AM572x SYSTEM.SchDoc
size 420 x 297 mm
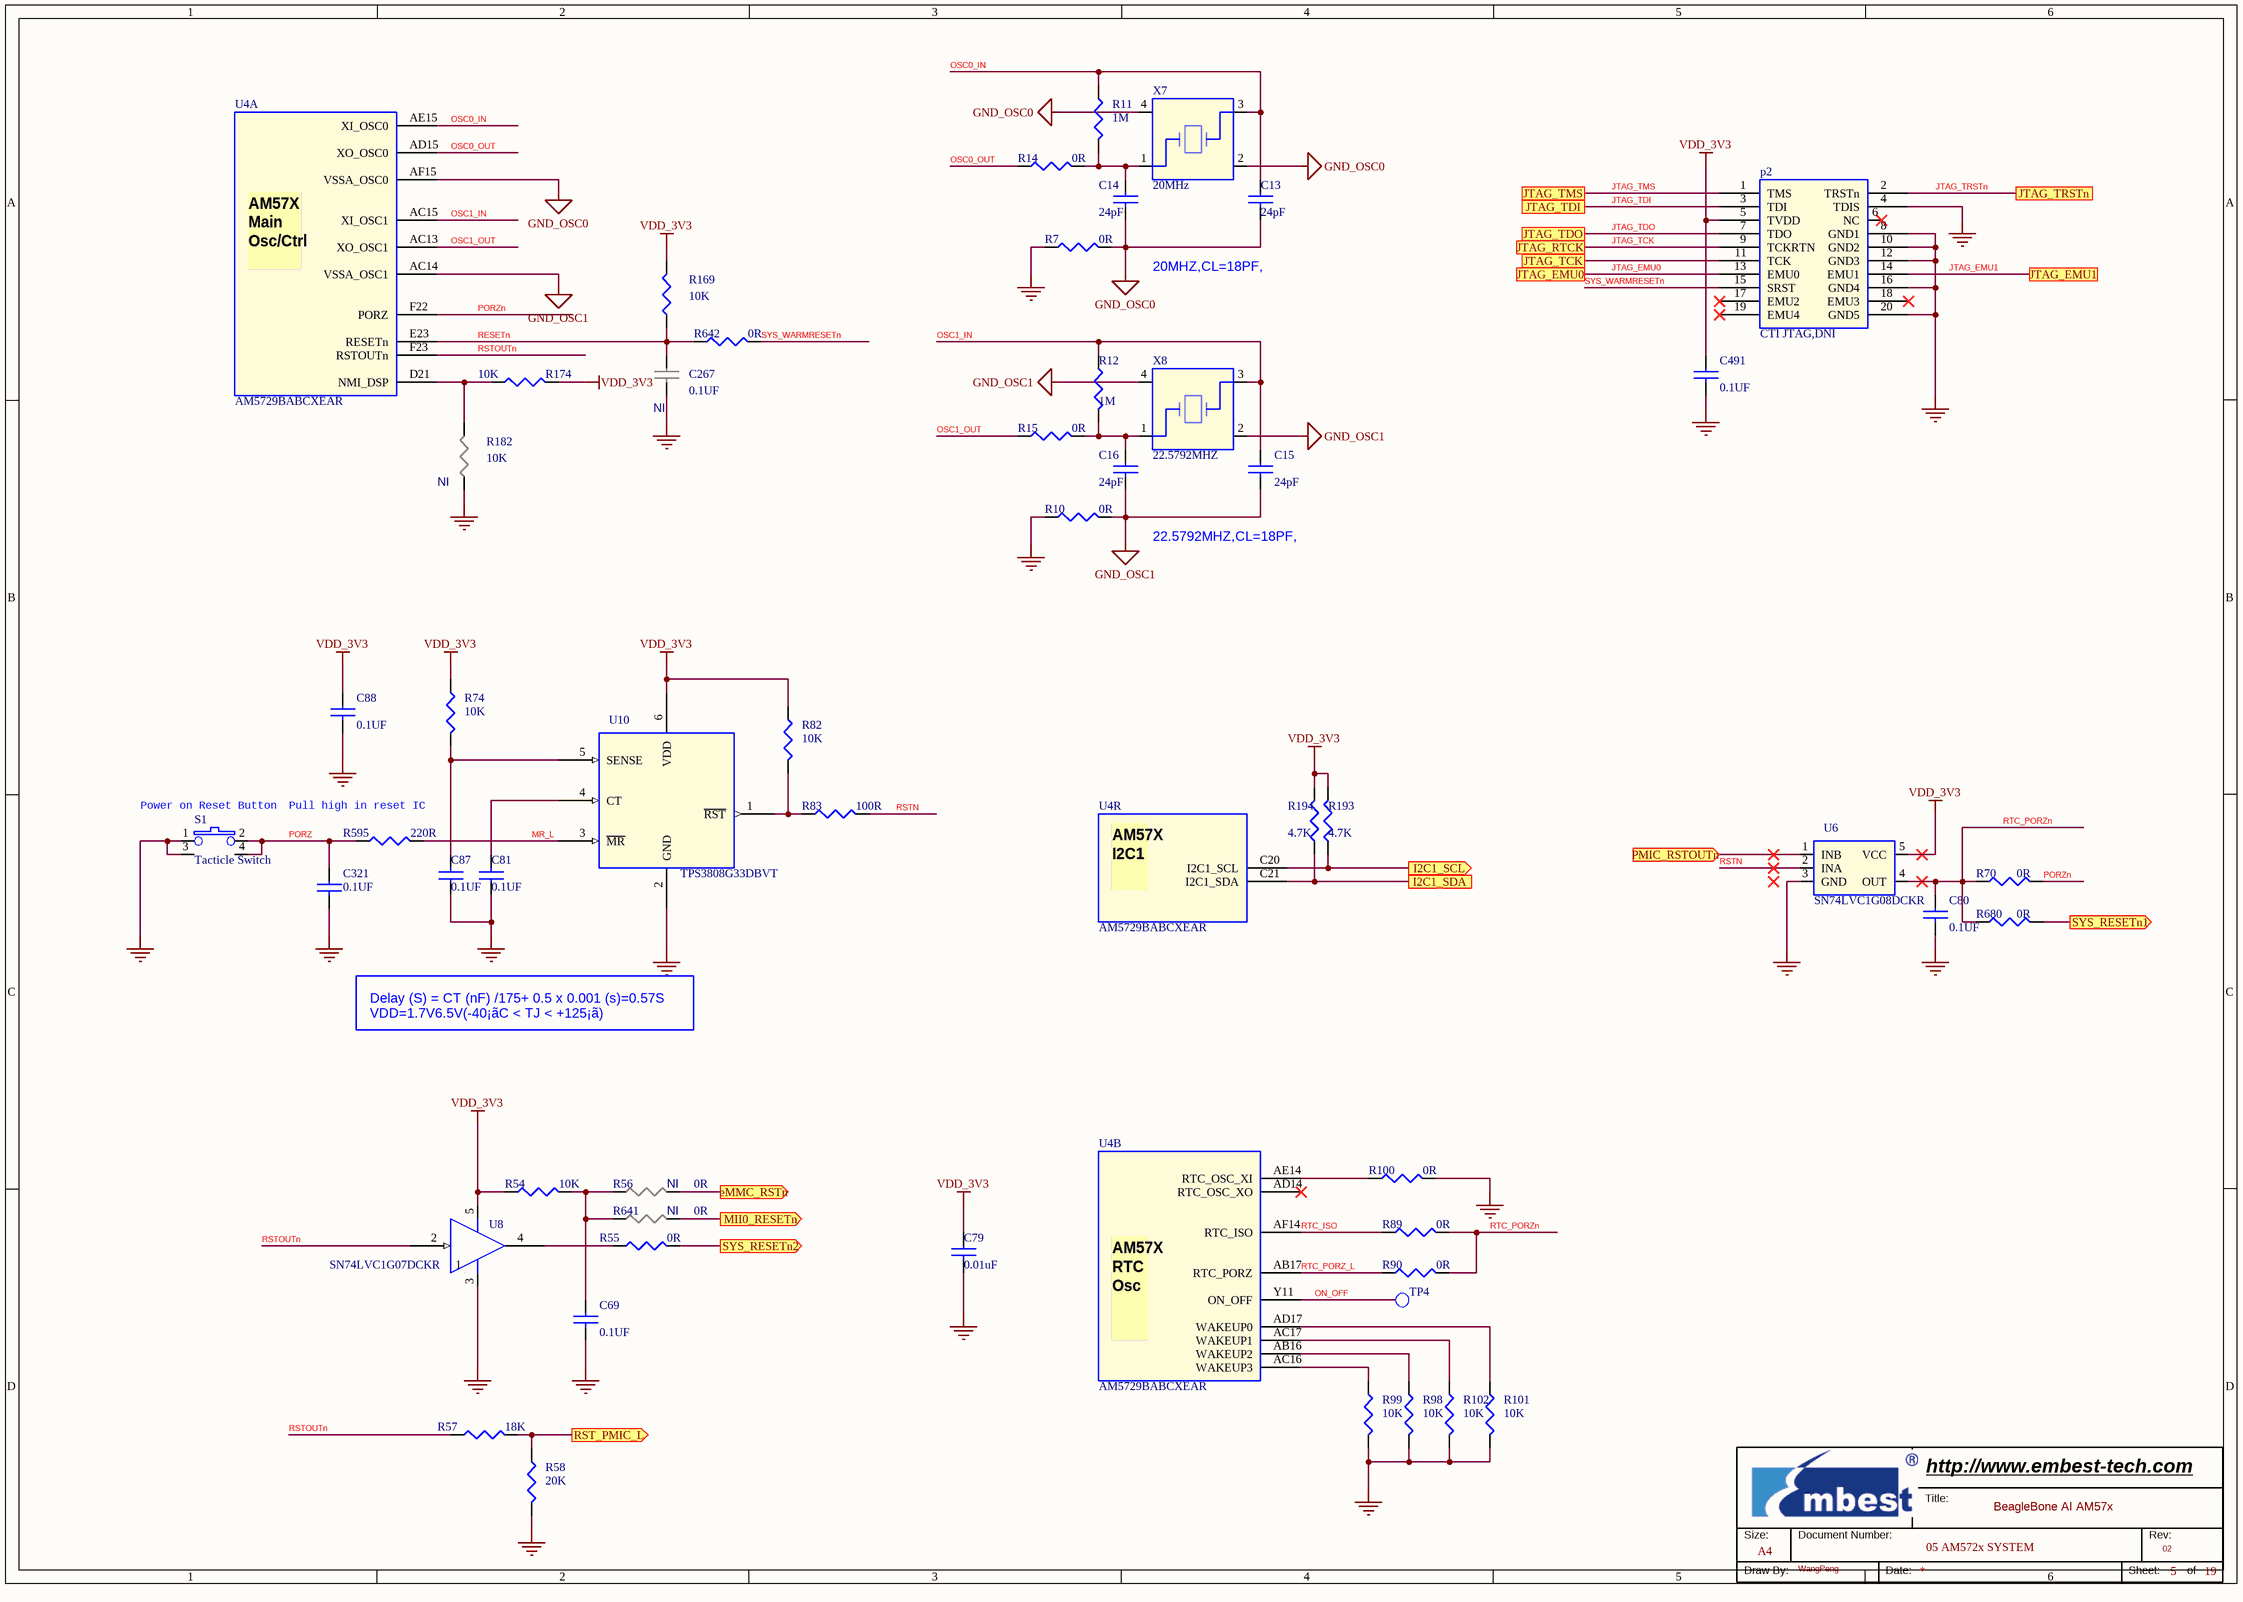
[diagram p3: 05 AM572x SYSTEM.SchDoc]

### Parts
(Parts that share a designator on the sheet are numbered #1, #2 ... from top to bottom, then left to right.)
*#3  Page Count: 19  Page Number: 5  Page Size: A4  Title: BeagleBone AI AM57x  RevCode: 02  Doc: 05 AM572x SYSTEM  Drawing: WangPeng  (hidden comment: Embest Title)  (graphical)
C13  24pF  [C0402]
C14  24pF  [C0402]
C15  24pF  [C0402]
C16  24pF  [C0402]
C69  0.1UF  [C0402]
C79  0.01uF  [C0402]
C80  0.1UF  [C0402]
C81  0.1UF  [C0402]
C87  0.1UF  [C0402]
C88  0.1UF  [C0402]
C267  0.1UF  ASSY: NI  [C0402]
C321  0.1UF  [C0402]
C491  0.1UF  [C0402]
p2  CTI JTAG,DNI  [header10x2]
R7  0R  [R0402]
R10  0R  [R0402]
R11  1M  [R0402]
R12  1M  [R0402]
R14  0R  [R0402]
R15  0R  [R0402]
R54  10K  [R0402]
R55  0R  [R0402]
R56  0R  ASSY: NI  [R0402]
R57  18K  [R0402]
R58  20K  [R0402]
R70  0R  [R0402]
R74  10K  [R0402]
R82  10K  [R0402]
R83  100R  [R0402]
R89  0R  [R0402]
R90  0R  [R0402]
R98  10K  [R0402]
R99  10K  [R0402]
R100  0R  [R0402]
R101  10K  [R0402]
R102  10K  [R0402]
R169  10K  [R0402]
R174  10K  [R0402]
R182  10K  ASSY: NI  [R0402]
R193  4.7K  [R0402]
R194  4.7K  [R0402]
R595  220R  [R0402]
R641  0R  ASSY: NI  [R0402]
R642  0R  [R0402]
R680  0R  [R0402]
S1  Tacticle Switch  [SWS4B46X28]
TP4  NI  [TP1-8040]  (value not drawn)
U4  AM5729BABCXEAR  [BGA23X23-760-117M]  (parts A,B,R of 29)
U6  SN74LVC1G08DCKR  [SC70_5]
U8  SN74LVC1G07DCKR  [SC70_5]
U10  TPS3808G33DBVT  [SOT23_6]
X7  20MHz  [OSCCC250x200x60-4N]
X8  22.5792MHZ  [OSCCC250x200x60-4N]

### Ports
eMMC_RSTn (out), I2C1_SCL (out), I2C1_SDA, JTAG_EMU0, JTAG_EMU1, JTAG_RTCK, JTAG_TCK, JTAG_TDI, JTAG_TDO, JTAG_TMS, JTAG_TRSTn, MII0_RESETn (out), PMIC_RSTOUTn (in), RST_PMIC_L (out), SYS_RESETn1 (out), SYS_RESETn2 (out)

### Nets
GND: C69.2 C79.2 C80.2 C81.1 C87.1 C88.2 C267.2 C321.2 C491.2 p2.4(TDIS) p2.8(GND1) p2.10(GND2) p2.12(GND3) p2.16(GND4) p2.20(GND5) R7.1 R10.1 R58.2 R98.2 R99.2 R100.2 R101.2 R102.2 R182.1 S1.1 S1.3 U6.3(GND) U8.3(GND) U10.2(GND)  [project net DDR1_RST]
GND_OSC0: C13.2 C14.2 R7.2 U4.AF15(VSSA_OSC0) X7.2 X7.4
GND_OSC1: C15.2 C16.2 R10.2 U4.AC14(VSSA_OSC1) X8.2 X8.4
VDD_3V3: C79.1 C88.1 C491.1 p2.5(TVDD) R54.1 R74.1 R82.1 R169.2 R174.2 R193.2 R194.2 U6.5(VCC) U8.5(VCC) U10.6(VDD)
I2C1_SCL: R193.1 U4.C20(I2C1_SCL) ; port I2C1_SCL
I2C1_SDA: R194.1 U4.C21(I2C1_SDA) ; port I2C1_SDA
JTAG_EMU0: p2.13(EMU0) ; port JTAG_EMU0
JTAG_EMU1: p2.14(EMU1) ; port JTAG_EMU1
JTAG_TCK: p2.9(TCKRTN) ; port JTAG_RTCK  [project net JTAG_RTCK]
JTAG_TCK: p2.11(TCK) ; port JTAG_TCK  [a separate net that carries the same name]
JTAG_TDI: p2.3(TDI) ; port JTAG_TDI
JTAG_TDO: p2.7(TDO) ; port JTAG_TDO
JTAG_TMS: p2.1(TMS) ; port JTAG_TMS
JTAG_TRSTn: p2.2(TRSTn) ; port JTAG_TRSTn
MII0_RESETn: R641.1 ; port MII0_RESETn
MR_L: R595.2 U10.3(~{MR})
ON_OFF: TP4.1(TP) U4.Y11(ON_OFF)
OSC0_IN: C13.1 R11.1 U4.AE15(XI_OSC0) X7.3
OSC0_OUT: R14.1 U4.AD15(XO_OSC0)
OSC1_IN: C15.1 R12.1 U4.AC15(XI_OSC1) X8.3
OSC1_OUT: R15.1 U4.AC13(XO_OSC1)
PORZ: C321.1 R595.1 S1.2 S1.4
PORZn: R70.2 U4.F22(PORZ)
RESETn: C267.1 R169.1 R642.1 U4.E23(RESETn)
RSTN: R83.2 U6.2(INA)
RSTOUTn: R57.1 U4.F23(RSTOUTn) U8.2(A)
RTC_ISO: R89.1 U4.AF14(RTC_ISO)
RTC_PORZ_L: R90.1 U4.AB17(RTC_PORZ)
RTC_PORZn: C80.1 R70.1 R89.2 R90.2 R680.1 U6.4(OUT)
SYS_WARMRESETn: p2.15(SRST) R642.2
NetC14_1: C14.1 R11.2 R14.2 X7.1
NetC16_1: C16.1 R12.2 R15.2 X8.1
NetC69_1: C69.1 R54.2 R56.2 R641.2
NetC81_2: C81.2 U10.4(CT)
NetC87_2: C87.2 R74.2 U10.5(SENSE)
Netp9_10: R55.2 ; port SYS_RESETn2
NetR55_1: R55.1 U8.4(Y)
NetR56_1: R56.1 ; port eMMC_RSTn
NetR57_2: R57.2 R58.1 ; port RST_PMIC_L
NetR82_2: R82.2 R83.1 U10.1(~{RST})
NetR98_1: R98.1 U4.AB16(WAKEUP2)
NetR99_1: R99.1 U4.AC16(WAKEUP3)
NetR100_1: R100.1 U4.AE14(RTC_OSC_XI)
NetR101_1: R101.1 U4.AD17(WAKEUP0)
NetR102_1: R102.1 U4.AC17(WAKEUP1)
NetR124_1: U6.1(INB) ; port PMIC_RSTOUTn
NetR174_1: R174.1 R182.2 U4.D21(NMI_DSP)
NetR680_2: R680.2 ; port SYS_RESETn1

Not connected (* = marked no-connect by the designer): p2 6(NC)* 17(EMU2)* 18(EMU3)* 19(EMU4)*; U4 AD14(RTC_OSC_XO)*; U8 1(NC)

### Notes on the sheet
- 20MHZ,CL=18PF,
- 22.5792MHZ,CL=18PF,
- (near S1) Power on Reset Button
- (near R595) Pull high in reset IC
- Delay (S) = CT (nF) /175+ 0.5 x 0.001 (s)=0.57S
  VDD=1.7V6.5V(-40¡ãC < TJ < +125¡ã)
- (in symbol AM57X, part A) AM57X / Main / Osc/Ctrl /
- (in symbol AM57X, part B) AM57X RTC / Osc /
- (in symbol AM57X, part R) AM57X / I2C1 /
- (in symbol Embest Title) Title:; Size:; Document Number:; Rev:; Draw By:; Date:; Sheet:; of

### Library data of the parts
C13 C14 = C: CAP,24pF,+/-5%,C0G,50V,SMD0402; Manufacturer: Murata; Manufacturer Part Number: GRM1555C1H240JA01D; Embest PN: 1004001100239; Part Type: Ceramic Capacitor
C15 C16 = C: CAP,24pF,+/-5%,C0G,50V,SMD0402; Manufacturer Part Number: GRM1555C1H240JA01D; Manufacturer: Murata; Embest PN: 1004001100239; Part Type: Ceramic Capacitor
C69 C87 C88 C321 = C: as C320 on sheet 03 PMIC1; Datasheet: Y:\ÐÂK3ÏµÍ³ÎïÁÏdatasheet\[1003_1004]capacitor-resistor µçÈÝ¡¢µç×è\1004001100047-GRM155R71C104KA88D.pdf; Part Type: Ceramic Capacitor
C79 = C: as C139 on sheet 03 PMIC1; Part Type: Ceramic Capacitor
C80 C81 C267 C491 = C: as C147 on sheet 03 PMIC1; Part Type: Ceramic Capacitor; Datasheet: Y:\ÐÂK3ÏµÍ³ÎïÁÏdatasheet\[1003_1004]capacitor-resistor µçÈÝ¡¢µç×è\1004001100047-GRM155R71C104KA88D.pdf
p2 = HDR_10x2_CJTAG_0: Dual Line Header 10x2pin Tin; TIIntPartnumber: 2H0039; MfrNum: FTR-110-03-G-D-06; PartName: HEADERCTIJTAG10x2Pin; PCB Footprint: SMD10x2Pin0.050in; Cost10K: 0.97; Cost100: 1.20; Vendor: Samtec; Mfr: Samtec
R7 R10 R14 R15 R55 R56 R70 R100 R642 = R: as R145 on sheet 03 PMIC1; Part Type: Thick film Resistor
R11 = R: RES,1M,+/-5%,1/16W,SMD0402; Manufacturer: YAGEO; Manufacturer Part Number: RC0402JR-071ML; Embest PN: 1003001100154; Part Type: Thick film Resistor
R12 = R: RES,1M,+/-5%,1/16W,SMD0402; Manufacturer Part Number: RC0402JR-071ML; Manufacturer: YAGEO; Embest PN: 1003001100154; Part Type: Thick film Resistor
R54 R74 R82 R98 R99 R101 R102 R169 R174 R182 = R: as R18 on sheet 03 PMIC1; Part Type: Thick film Resistor
R57 = R: RES,18K,+/-1%,1/16W,SMD0402; Manufacturer: YAGEO; Manufacturer Part Number: RC0402FR-0718KL; Embest PN: 1003001100645; Part Type: Thick film Resistor
R58 = R: RES,20K,+/-1%,1/16W,SMD0402; Manufacturer: YAGEO; Manufacturer Part Number: RC0402FR-0720KL; Embest PN: 1003001100083; Part Type: Thick film Resistor
R83 = R: RES,100R,+/-5%,1/16W,SMD0402; Manufacturer: YAGEO; Manufacturer Part Number: RC0402JR-07100RL; Embest PN: 1003001100020; Part Type: Thick film Resistor
R89 R90 R641 R680 = R: as R108 on sheet 03 PMIC1; Part Type: Thick film Resistor
R193 R194 = R: RES,4K7,+/-5%,1/16W,SMD0402; Manufacturer: YAGEO; Manufacturer Part Number: RC0402JR-074K7L; Embest PN: 1003001100057; Part Type: Thick film Resistor
R595 = R: RES,220R,+/-5%,1/16W,SMD0402; Manufacturer Part Number: RC0402JR-07220RL; Manufacturer: YAGEO; Embest PN: 1003001100025; Part Type: Thick film Resistor
S1 = PSW4: as S3 on sheet 03 PMIC1; Datasheet: Y:\ÐÂK3ÏµÍ³ÎïÁÏdatasheet\[1010]switches ¿ª¹Ø°´¼ü\1010001100030_KMR231GLFS_C&K.pdf; Part Type: TACT
TP4 = TEST POINT: as TP2 on sheet 03 PMIC1; Part Type: TP
U4 = AM57X: IC ARM Dual Cortex-A15 Microprocessor FCBGA(ABC)-760 SMD JEDEC TRAY; Vendor: TI; Embest PN: 1002001100053; Status: BeagleBone AI; Manufacturer Part Number: AM5729BABCXEAR; Manufacturer: TI; Part Type: MPU
U6 = SN74LVC1G08DCKR: IC,SINGLE 2-INPUT POSITIVE-AND GATE,SN74LVC1G08DCKR,SOT-353,SMD; Manufacturer: TI; Embest PN: 1002008100067; Datasheet: Y:\ÐÂK3ÏµÍ³ÎïÁÏdatasheet\[1002]IC ¼¯³ÉµçÂ·\1002008100067-sn74lvc1g08.pdf; Status: AVL; Manufacturer Part Number: SN74LVC1G08DCKR; Part Type: Logic
U8 = SN74LVC1G07DCKR: IC,SINGLE BUFFER/DRIVER WITH OPEN-DRAIN OUTPUT,SN74LVC1G07DCKR,SC-70,SMD; Manufacturer: TI; Embest PN: 1002008100087; Part Type: Logic; Manufacturer Part Number: SN74LVC1G07DCKR; Datasheet: Y:\ÐÂK3ÏµÍ³ÎïÁÏdatasheet\[1002]IC ¼¯³ÉµçÂ·\1002008100087 sn74lvc1g07 ti.pdf
U10 = TPS3808G: IC,Low Quiescent Current, Programmable-Delay / Supervisory Circuit,TPS3808G33DBVT,SOT-23,SMD; Manufacturer: TI; Embest PN: 1002009100021; Part Type: Monitor; Manufacturer Part Number: TPS3808G33DBVT; Datasheet: Y:\ÐÂK3ÏµÍ³ÎïÁÏdatasheet\[1002]IC ¼¯³ÉµçÂ·\1002009100021_tps3808g01_TI.pdf
X7 = X4: Crystal,5ZAA20000181TFA2Q3,20MHz,+/-10PPM,18PF,2520-4 pads,SMD; Manufacturer: INTERQUIP; Rating: 10PPM; Embest PN: 1008002100253; Datasheet: Y:\ÐÂK3ÏµÍ³ÎïÁÏdatasheet\[1008]crystal ¾§Ìå\1008002100253 5ZAA20000181TFA2Q3¹æ¸ñÊé.pdf; Status: Hamster AM572x; Manufacturer Part Number: 5ZAA20000181TFA2Q3; Part Type: Crystal
X8 = X4: Crystal,5ZAA22579182TFA0Q3,22.5792MHz,+/-20PPM,18PF,2520-4 pads,SMD; Manufacturer: INTERQUIP; Embest PN: 1008002100254; Rating: 20PPM; Part Type: Crystal; Manufacturer Part Number: 5ZAA22579182TFA0Q3; Status: Hamster AM572x; Datasheet: Y:\ÐÂK3ÏµÍ³ÎïÁÏdatasheet\[1008]crystal ¾§Ìå\1008002100254 5ZAA22579182TFA0Q3¹æ¸ñÊé.pdf
*#3 = Embest Title: Page Create Date: May 29, 2006; WebSite: http://www.embest-tech.com; Company: Embest; Page Modify Date: *

## Sheet 06 DDR PART1.SchDoc
size 420 x 297 mm
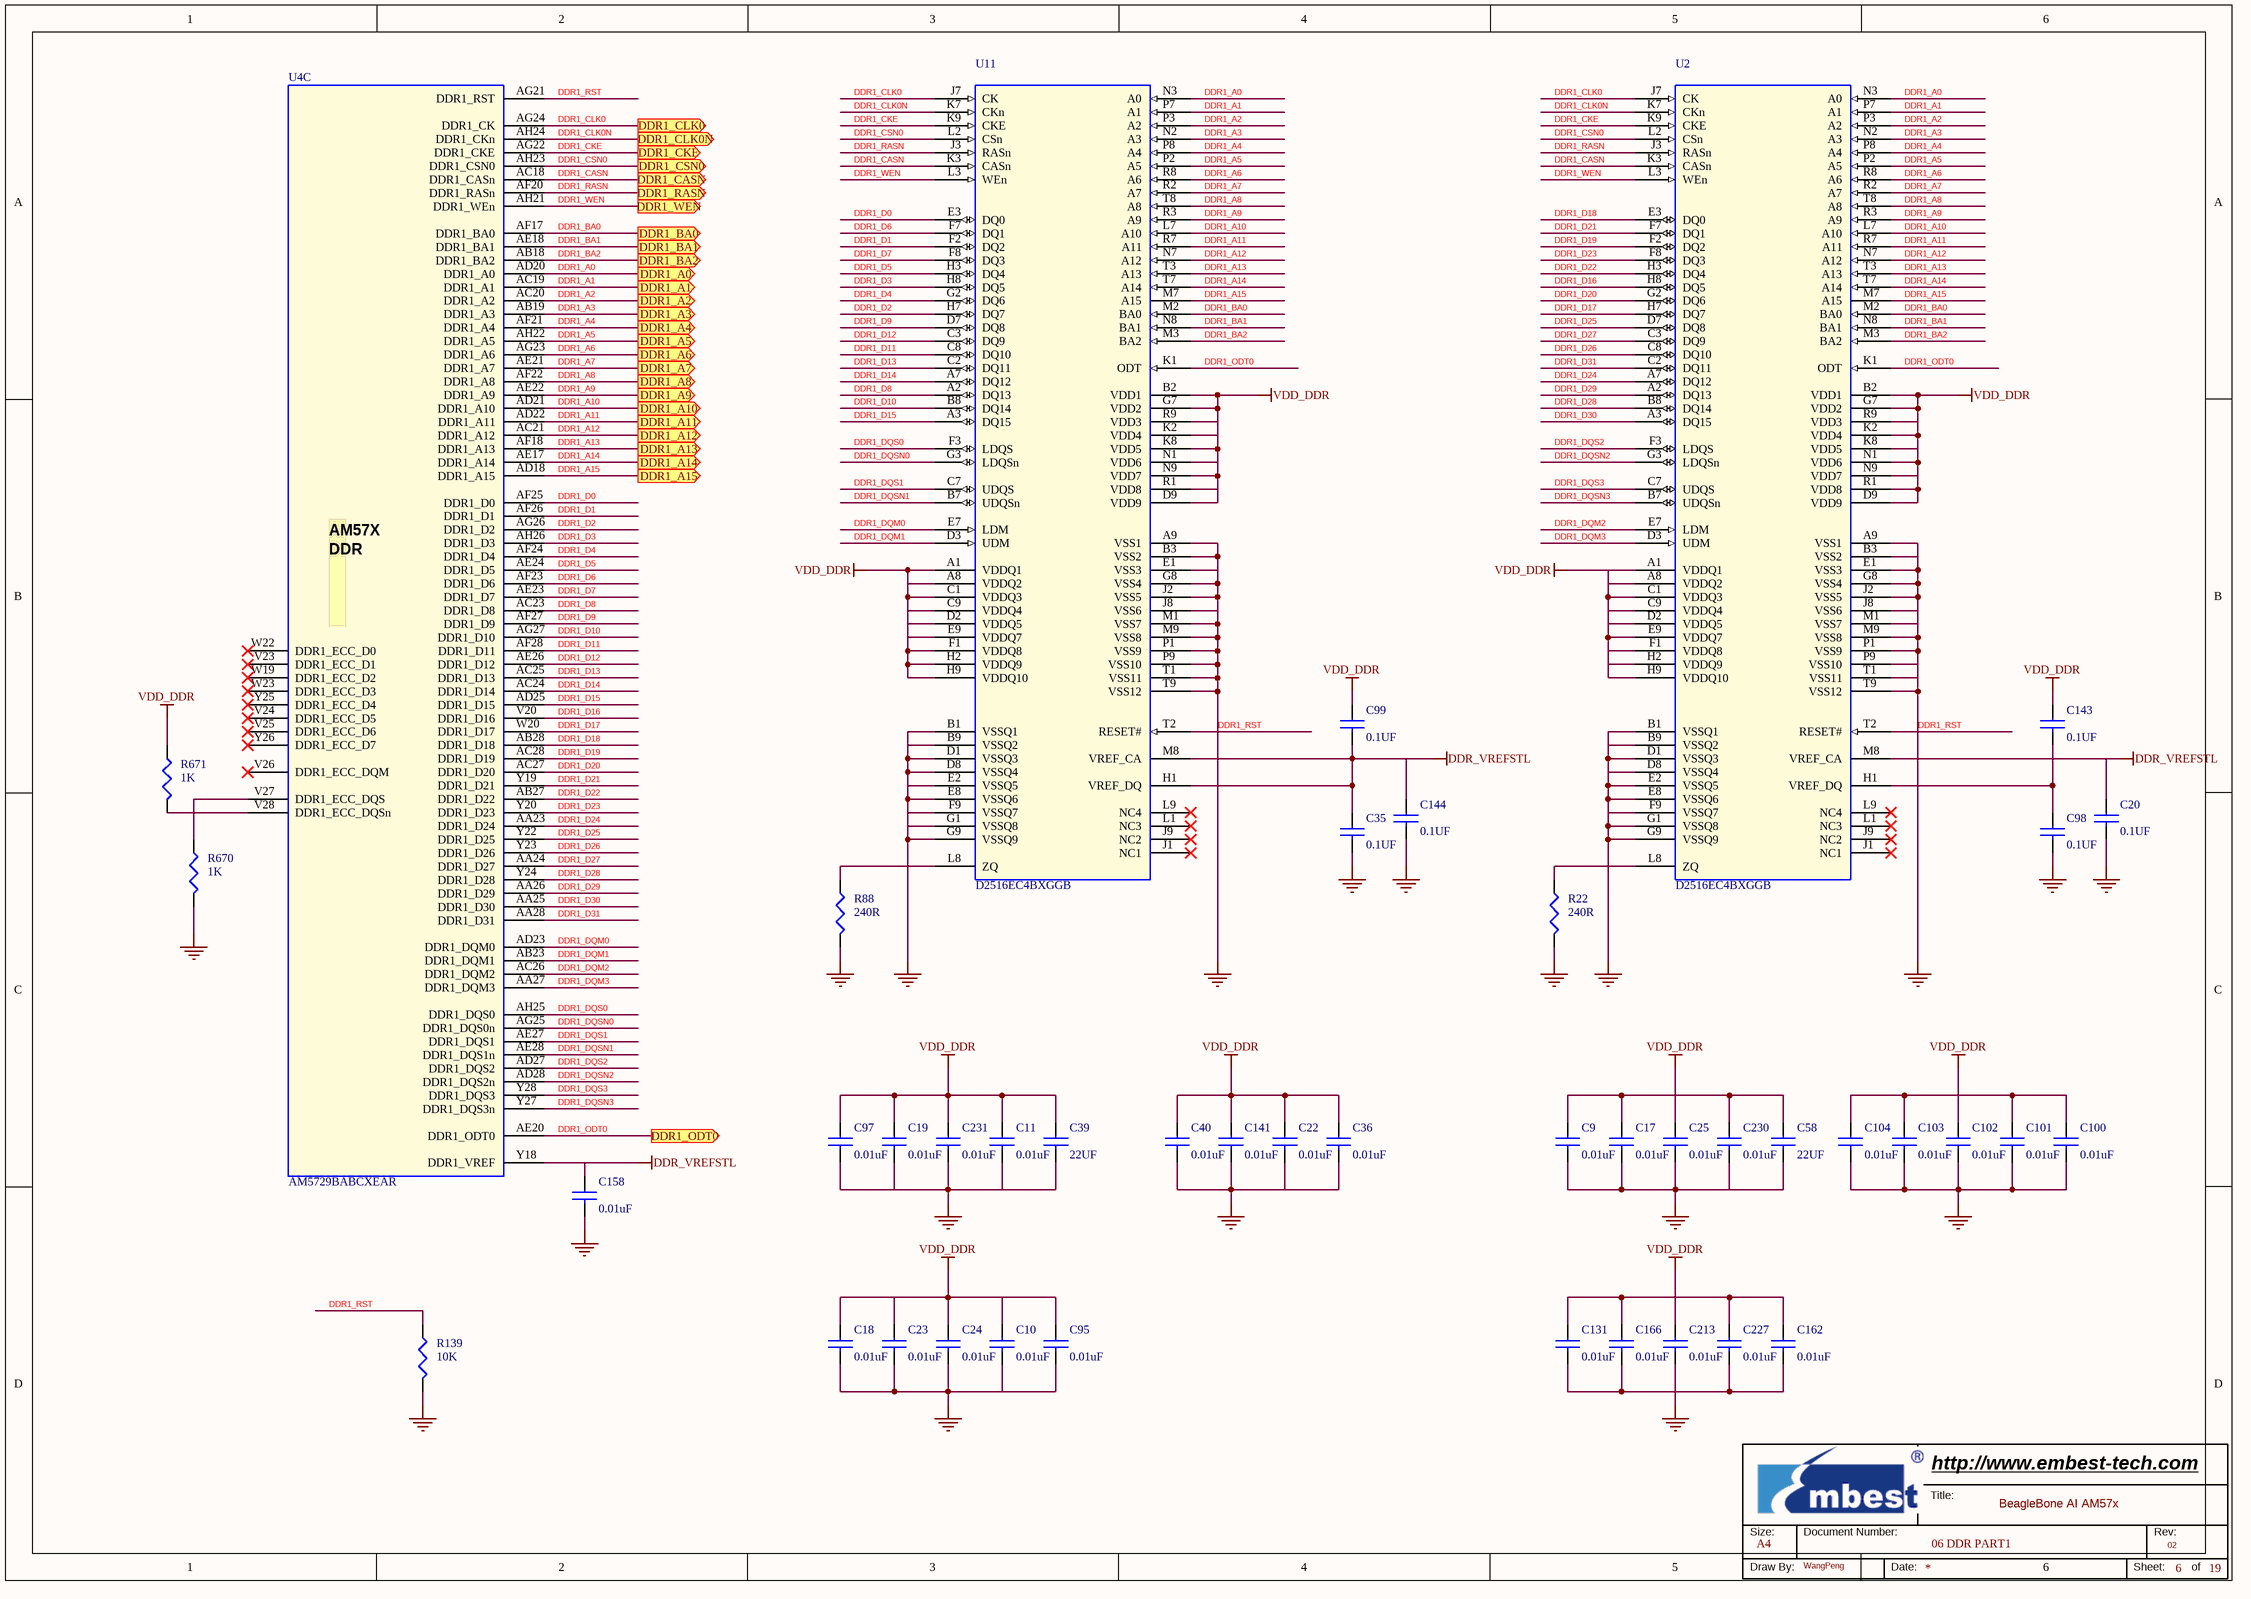
[diagram p4: 06 DDR PART1.SchDoc]

### Parts
(Parts that share a designator on the sheet are numbered #1, #2 ... from top to bottom, then left to right.)
*#4  Page Count: 19  Page Number: 6  Page Size: A4  Title: BeagleBone AI AM57x  RevCode: 02  Doc: 06 DDR PART1  Drawing: WangPeng  (hidden comment: Embest Title)  (graphical)
C9  0.01uF  [C0402]
C10  0.01uF  [C0402]
C11  0.01uF  [C0402]
C17  0.01uF  [C0402]
C18  0.01uF  [C0402]
C19  0.01uF  [C0402]
C20  0.1UF  [C0402]
C22  0.01uF  [C0402]
C23  0.01uF  [C0402]
C24  0.01uF  [C0402]
C25  0.01uF  [C0402]
C35  0.1UF  [C0402]
C36  0.01uF  [C0402]
C39  22UF  [C0603]
C40  0.01uF  [C0402]
C58  22UF  [C0603]
C95  0.01uF  [C0402]
C97  0.01uF  [C0402]
C98  0.1UF  [C0402]
C99  0.1UF  [C0402]
C100  0.01uF  [C0402]
C101  0.01uF  [C0402]
C102  0.01uF  [C0402]
C103  0.01uF  [C0402]
C104  0.01uF  [C0402]
C131  0.01uF  [C0402]
C141  0.01uF  [C0402]
C143  0.1UF  [C0402]
C144  0.1UF  [C0402]
C158  0.01uF  [C0402]
C162  0.01uF  [C0402]
C166  0.01uF  [C0402]
C213  0.01uF  [C0402]
C227  0.01uF  [C0402]
C230  0.01uF  [C0402]
C231  0.01uF  [C0402]
R22  240R  [R0402]
R88  240R  [R0402]
R139  10K  [R0402]
R670  1K  [R0402]
R671  1K  [R0402]
U2  D2516EC4BXGGB  [ddr2_fbga60pin]
U4  AM5729BABCXEAR  [BGA23X23-760-117M]  (part C of 29)
U11  D2516EC4BXGGB  [ddr2_fbga60pin]

### Ports
DDR1_A0 (out), DDR1_A1 (out), DDR1_A2 (out), DDR1_A3 (out), DDR1_A4 (out), DDR1_A5 (out), DDR1_A6 (out), DDR1_A7 (out), DDR1_A8 (out), DDR1_A9 (out), DDR1_A10 (out), DDR1_A11 (out), DDR1_A12 (out), DDR1_A13 (out), DDR1_A14 (out), DDR1_A15 (out), DDR1_BA0 (out), DDR1_BA1 (out), DDR1_BA2 (out), DDR1_CASN (out), DDR1_CKE (out), DDR1_CLK0 (out), DDR1_CLK0N (out), DDR1_CSN0 (out), DDR1_ODT0 (out), DDR1_RASN (out), DDR1_WEN (out)

### Nets
DDR1_RST: C9.2 C10.2 C11.2 C17.2 C18.2 C19.2 C20.2 C22.2 C23.2 C24.2 C25.2 C35.2 C36.2 C39.2 C40.2 C58.2 C95.2 C97.2 C98.2 C100.2 C101.2 C102.2 C103.2 C104.2 C141.2 C144.2 C158.2 C213.2 C230.2 C231.2 R22.2 R88.2 R139.1 R139.2 R670.2 U2.A9(VSS1) U2.B1(VSSQ1) U2.B3(VSS2) U2.B9(VSSQ2) U2.D1(VSSQ3) U2.D8(VSSQ4) U2.E1(VSS3) U2.E2(VSSQ5) U2.E8(VSSQ6) U2.F9(VSSQ7) U2.G1(VSSQ8) U2.G8(VSS4) U2.G9(VSSQ9) U2.J2(VSS5) U2.J8(VSS6) U2.M1(VSS7) U2.M9(VSS8) U2.P1(VSS9) U2.P9(VSS10) U2.T1(VSS11) U2.T2(RESET#) U2.T9(VSS12) U4.AG21(DDR1_RST) U11.A9(VSS1) U11.B1(VSSQ1) U11.B3(VSS2) U11.B9(VSSQ2) U11.D1(VSSQ3) U11.D8(VSSQ4) U11.E1(VSS3) U11.E2(VSSQ5) U11.E8(VSSQ6) U11.F9(VSSQ7) U11.G1(VSSQ8) U11.G8(VSS4) U11.G9(VSSQ9) U11.J2(VSS5) U11.J8(VSS6) U11.M1(VSS7) U11.M9(VSS8) U11.P1(VSS9) U11.P9(VSS10) U11.T1(VSS11) U11.T2(RESET#) U11.T9(VSS12)  [also labelled GND]
DDR_VREFSTL: C20.1 C35.1 C99.2 C144.1 C158.1 U2.M8(VREF_CA) U4.Y18(DDR1_VREF) U11.H1(VREF_DQ) U11.M8(VREF_CA)
VDD_DDR: C10.1 C11.1 C18.1 C19.1 C22.1 C23.1 C24.1 C25.1 C36.1 C39.1 C40.1 C95.1 C97.1 C99.1 C102.1 C141.1 C143.1 C213.1 C231.1 R671.1 U2.A1(VDDQ1) U2.A8(VDDQ2) U2.B2(VDD1) U2.C1(VDDQ3) U2.C9(VDDQ4) U2.D2(VDDQ5) U2.D9(VDD9) U2.E9(VDDQ7) U2.F1(VDDQ8) U2.G7(VDD2) U2.H2(VDDQ9) U2.H9(VDDQ10) U2.K2(VDD4) U2.K8(VDD5) U2.N1(VDD6) U2.N9(VDD7) U2.R1(VDD8) U2.R9(VDD3) U11.A1(VDDQ1) U11.A8(VDDQ2) U11.B2(VDD1) U11.C1(VDDQ3) U11.C9(VDDQ4) U11.D2(VDDQ5) U11.D9(VDD9) U11.E9(VDDQ7) U11.F1(VDDQ8) U11.G7(VDD2) U11.H2(VDDQ9) U11.H9(VDDQ10) U11.K2(VDD4) U11.K8(VDD5) U11.N1(VDD6) U11.N9(VDD7) U11.R1(VDD8) U11.R9(VDD3)
DDR1_A0: U2.N3(A0) U4.AD20(DDR1_A0) U11.N3(A0) ; port DDR1_A0
DDR1_A1: U2.P7(A1) U4.AC19(DDR1_A1) U11.P7(A1) ; port DDR1_A1
DDR1_A2: U2.P3(A2) U4.AC20(DDR1_A2) U11.P3(A2) ; port DDR1_A2
DDR1_A3: U2.N2(A3) U4.AB19(DDR1_A3) U11.N2(A3) ; port DDR1_A3
DDR1_A4: U2.P8(A4) U4.AF21(DDR1_A4) U11.P8(A4) ; port DDR1_A4
DDR1_A5: U2.P2(A5) U4.AH22(DDR1_A5) U11.P2(A5) ; port DDR1_A5
DDR1_A6: U2.R8(A6) U4.AG23(DDR1_A6) U11.R8(A6) ; port DDR1_A6
DDR1_A7: U2.R2(A7) U4.AE21(DDR1_A7) U11.R2(A7) ; port DDR1_A7
DDR1_A8: U2.T8(A8) U4.AF22(DDR1_A8) U11.T8(A8) ; port DDR1_A8
DDR1_A9: U2.R3(A9) U4.AE22(DDR1_A9) U11.R3(A9) ; port DDR1_A9
DDR1_A10: U2.L7(A10) U4.AD21(DDR1_A10) U11.L7(A10) ; port DDR1_A10
DDR1_A11: U2.R7(A11) U4.AD22(DDR1_A11) U11.R7(A11) ; port DDR1_A11
DDR1_A12: U2.N7(A12) U4.AC21(DDR1_A12) U11.N7(A12) ; port DDR1_A12
DDR1_A13: U2.T3(A13) U4.AF18(DDR1_A13) U11.T3(A13) ; port DDR1_A13
DDR1_A14: U2.T7(A14) U4.AE17(DDR1_A14) U11.T7(A14) ; port DDR1_A14
DDR1_A15: U2.M7(A15) U4.AD18(DDR1_A15) U11.M7(A15) ; port DDR1_A15
DDR1_BA0: U2.M2(BA0) U4.AF17(DDR1_BA0) U11.M2(BA0) ; port DDR1_BA0
DDR1_BA1: U2.N8(BA1) U4.AE18(DDR1_BA1) U11.N8(BA1) ; port DDR1_BA1
DDR1_BA2: U2.M3(BA2) U4.AB18(DDR1_BA2) U11.M3(BA2) ; port DDR1_BA2
DDR1_CASN: U2.K3(CASn) U4.AC18(DDR1_CASn) U11.K3(CASn) ; port DDR1_CASN
DDR1_CKE: U2.K9(CKE) U4.AG22(DDR1_CKE) U11.K9(CKE) ; port DDR1_CKE
DDR1_CLK0: U2.J7(CK) U4.AG24(DDR1_CK) U11.J7(CK) ; port DDR1_CLK0
DDR1_CLK0N: U2.K7(CKn) U4.AH24(DDR1_CKn) U11.K7(CKn) ; port DDR1_CLK0N
DDR1_CSN0: U2.L2(CSn) U4.AH23(DDR1_CSN0) U11.L2(CSn) ; port DDR1_CSN0
DDR1_D0: U4.AF25(DDR1_D0) U11.E3(DQ0)
DDR1_D1: U4.AF26(DDR1_D1) U11.F2(DQ2)
DDR1_D2: U4.AG26(DDR1_D2) U11.H7(DQ7)
DDR1_D3: U4.AH26(DDR1_D3) U11.H8(DQ5)
DDR1_D4: U4.AF24(DDR1_D4) U11.G2(DQ6)
DDR1_D5: U4.AE24(DDR1_D5) U11.H3(DQ4)
DDR1_D6: U4.AF23(DDR1_D6) U11.F7(DQ1)
DDR1_D7: U4.AE23(DDR1_D7) U11.F8(DQ3)
DDR1_D8: U4.AC23(DDR1_D8) U11.A2(DQ13)
DDR1_D9: U4.AF27(DDR1_D9) U11.D7(DQ8)
DDR1_D10: U4.AG27(DDR1_D10) U11.B8(DQ14)
DDR1_D11: U4.AF28(DDR1_D11) U11.C8(DQ10)
DDR1_D12: U4.AE26(DDR1_D12) U11.C3(DQ9)
DDR1_D13: U4.AC25(DDR1_D13) U11.C2(DQ11)
DDR1_D14: U4.AC24(DDR1_D14) U11.A7(DQ12)
DDR1_D15: U4.AD25(DDR1_D15) U11.A3(DQ15)
DDR1_D16: U2.H8(DQ5) U4.V20(DDR1_D16)
DDR1_D17: U2.H7(DQ7) U4.W20(DDR1_D17)
DDR1_D18: U2.E3(DQ0) U4.AB28(DDR1_D18)
DDR1_D19: U2.F2(DQ2) U4.AC28(DDR1_D19)
DDR1_D20: U2.G2(DQ6) U4.AC27(DDR1_D20)
DDR1_D21: U2.F7(DQ1) U4.Y19(DDR1_D21)
DDR1_D22: U2.H3(DQ4) U4.AB27(DDR1_D22)
DDR1_D23: U2.F8(DQ3) U4.Y20(DDR1_D23)
DDR1_D24: U2.A7(DQ12) U4.AA23(DDR1_D24)
DDR1_D25: U2.D7(DQ8) U4.Y22(DDR1_D25)
DDR1_D26: U2.C8(DQ10) U4.Y23(DDR1_D26)
DDR1_D27: U2.C3(DQ9) U4.AA24(DDR1_D27)
DDR1_D28: U2.B8(DQ14) U4.Y24(DDR1_D28)
DDR1_D29: U2.A2(DQ13) U4.AA26(DDR1_D29)
DDR1_D30: U2.A3(DQ15) U4.AA25(DDR1_D30)
DDR1_D31: U2.C2(DQ11) U4.AA28(DDR1_D31)
DDR1_DQM0: U4.AD23(DDR1_DQM0) U11.E7(LDM)
DDR1_DQM1: U4.AB23(DDR1_DQM1) U11.D3(UDM)
DDR1_DQM2: U2.E7(LDM) U4.AC26(DDR1_DQM2)
DDR1_DQM3: U2.D3(UDM) U4.AA27(DDR1_DQM3)
DDR1_DQS0: U4.AH25(DDR1_DQS0) U11.F3(LDQS)
DDR1_DQS1: U4.AE27(DDR1_DQS1) U11.C7(UDQS)
DDR1_DQS2: U2.F3(LDQS) U4.AD27(DDR1_DQS2)
DDR1_DQS3: U2.C7(UDQS) U4.Y28(DDR1_DQS3)
DDR1_DQSN0: U4.AG25(DDR1_DQS0n) U11.G3(LDQSn)
DDR1_DQSN1: U4.AE28(DDR1_DQS1n) U11.B7(UDQSn)
DDR1_DQSN2: U2.G3(LDQSn) U4.AD28(DDR1_DQS2n)
DDR1_DQSN3: U2.B7(UDQSn) U4.Y27(DDR1_DQS3n)
DDR1_ODT0: U2.K1(ODT) U4.AE20(DDR1_ODT0) U11.K1(ODT) ; port DDR1_ODT0
DDR1_RASN: U2.J3(RASn) U4.AF20(DDR1_RASn) U11.J3(RASn) ; port DDR1_RASN
DDR1_WEN: U2.L3(WEn) U4.AH21(DDR1_WEn) U11.L3(WEn) ; port DDR1_WEN
NetC9_1: C9.1 C17.1 C58.1 C230.1
NetC98_1: C98.1 C143.2 U2.H1(VREF_DQ)
NetC100_1: C100.1 C101.1 C103.1 C104.1
NetC131_1: C131.1 C162.1 C166.1 C227.1
NetC131_2: C131.2 C162.2 C166.2 C227.2
NetR22_1: R22.1 U2.L8(ZQ)
NetR88_1: R88.1 U11.L8(ZQ)
NetR670_1: R670.1 U4.V27(DDR1_ECC_DQS)
NetR671_2: R671.2 U4.V28(DDR1_ECC_DQSn)

Not connected (* = marked no-connect by the designer): U2 J1(NC1)* J9(NC2)* L1(NC3)* L9(NC4)*; U4 V23(DDR1_ECC_D1)* V24(DDR1_ECC_D5)* V25(DDR1_ECC_D6)* V26(DDR1_ECC_DQM)* W19(DDR1_ECC_D2)* W22(DDR1_ECC_D0)* W23(DDR1_ECC_D3)* Y25(DDR1_ECC_D4)* Y26(DDR1_ECC_D7)*; U11 J1(NC1)* J9(NC2)* L1(NC3)* L9(NC4)*

### Notes on the sheet
- (in symbol AM57X, part C) AM57X DDR /
- (in symbol Embest Title) Title:; Size:; Document Number:; Rev:; Draw By:; Date:; Sheet:; of

### Library data of the parts
C9 C17 C18 C23 C103 C104 C131 C166 = C: CAP,10NF,+/-10%,X7R,16V,SMD0402; Manufacturer: MURATA; Manufacturer Part Number: GRM155R71C103KA01D; Embest PN: 1004001100039; Part Type: Ceramic Capacitor
C10 C11 C22 C24 C25 C36 C95 C100-C102 C162 C213 C227 C230 C231 = C: as C139 on sheet 03 PMIC1; Part Type: Ceramic Capacitor
C19 C40 C97 C158 = C: CAP,10NF,+/-10%,X7R,16V,SMD0402; Manufacturer: MURATA; Manufacturer Part Number: GRM155R71C103KA01D; SIGNAL_MODEL: CAP_0.1UF_X7R_16V_10%_0402__402_0.1uf_16V; Embest PN: 1004001100039; Part Type: Ceramic Capacitor
C20 C35 C98 C144 = C: as C147 on sheet 03 PMIC1; Part Type: Ceramic Capacitor; Datasheet: Y:\ÐÂK3ÏµÍ³ÎïÁÏdatasheet\[1003_1004]capacitor-resistor µçÈÝ¡¢µç×è\1004001100047-GRM155R71C104KA88D.pdf
C39 = C: CAP,22UF,+/-20%,X5R,6.3V,SMD0603; Manufacturer: MURATA; Manufacturer Part Number: GRM188R60J226MEA0D; Embest PN: 1004001100130; Part Type: Ceramic Capacitor
C58 = C: CAP,22UF,+/-20%,x5R,10V,SMD0603; Manufacturer: Murata; Manufacturer Part Number: GRM188R61A226ME15D; Embest PN: 1004001100311; Part Type: Ceramic Capacitor; Datasheet: Y:\ÐÂK3ÏµÍ³ÎïÁÏdatasheet\[1003_1004]capacitor-resistor µçÈÝ¡¢µç×è\1004001100311 GRM188R61A226ME15D murata.pdf
C99 = C: CAP,100NF,+/-10%,X7R,16V,SMD0402; Manufacturer Part Number: GRM155R71C104KA88D; Manufacturer: Murata; SIGNAL_MODEL: CAP_0.1UF_X7R_16V_10%_0402__402_0.1uf_16V; Embest PN: 1004001100047; Datasheet: Y:\ÐÂK3ÏµÍ³ÎïÁÏdatasheet\[1003_1004]capacitor-resistor µçÈÝ¡¢µç×è\1004001100047-GRM155R71C104KA88D.pdf; Part Type: Ceramic Capacitor
C141 = C: CAP,10NF,+/-10%,X7R,16V,SMD0402; Manufacturer Part Number: GRM155R71C103KA01D; Manufacturer: MURATA; SIGNAL_MODEL: CAP_0.1UF_X7R_16V_10%_0402__402_0.1uf_16V; Embest PN: 1004001100039; Part Type: Ceramic Capacitor
C143 = C: as C320 on sheet 03 PMIC1; Datasheet: Y:\ÐÂK3ÏµÍ³ÎïÁÏdatasheet\[1003_1004]capacitor-resistor µçÈÝ¡¢µç×è\1004001100047-GRM155R71C104KA88D.pdf; Part Type: Ceramic Capacitor
R22 = R: RES,240R,+/-1%,1/16W,SMD0402; Manufacturer Part Number: RC0402FR-07240RL; Manufacturer: YAGEO; SIGNAL_MODEL: RES_0_1/16W_1%_0402_402_0_1%_0_1%; Embest PN: 1003001100026; Part Type: Thick film Resistor
R88 = R: RES,240R,+/-1%,1/16W,SMD0402; Manufacturer: YAGEO; Manufacturer Part Number: RC0402FR-07240RL; Embest PN: 1003001100026; Part Type: Thick film Resistor
R139 = R: as R18 on sheet 03 PMIC1; Part Type: Thick film Resistor
R670 = R: as R147 on sheet 03 PMIC1; Part Type: Thick film Resistor
R671 = R: as R150 on sheet 03 PMIC1; Part Type: Thick film Resistor
U2 U11 = D2516EC4BXGGB_0: IC,DDR3L 4 GB (256M x 16) DDR3/3L-1600 Mbps DRAM - FBGA-96 Tray; Manufacturer: KINGSTON; Embest PN: 1002003100222; Datasheet: Y:\ÐÂK3ÏµÍ³ÎïÁÏdatasheet\[1002]IC ¼¯³ÉµçÂ·\1002003100222 D2516EC4BXGGB.pdf; Status: TBD; Manufacturer Part Number: D2516EC4BXGGB; Part Type: Memory
U4 = AM57X: as U4 on sheet 05 AM572x SYSTEM; Part Type: MPU; Manufacturer: TI; Manufacturer Part Number: AM5729BABCXEAR; Status: BeagleBone AI
*#4 = Embest Title: Page Create Date: May 29, 2006; WebSite: http://www.embest-tech.com; Company: Embest; Page Modify Date: *

## Sheet 07 DDR PART2.SchDoc
size 420 x 297 mm
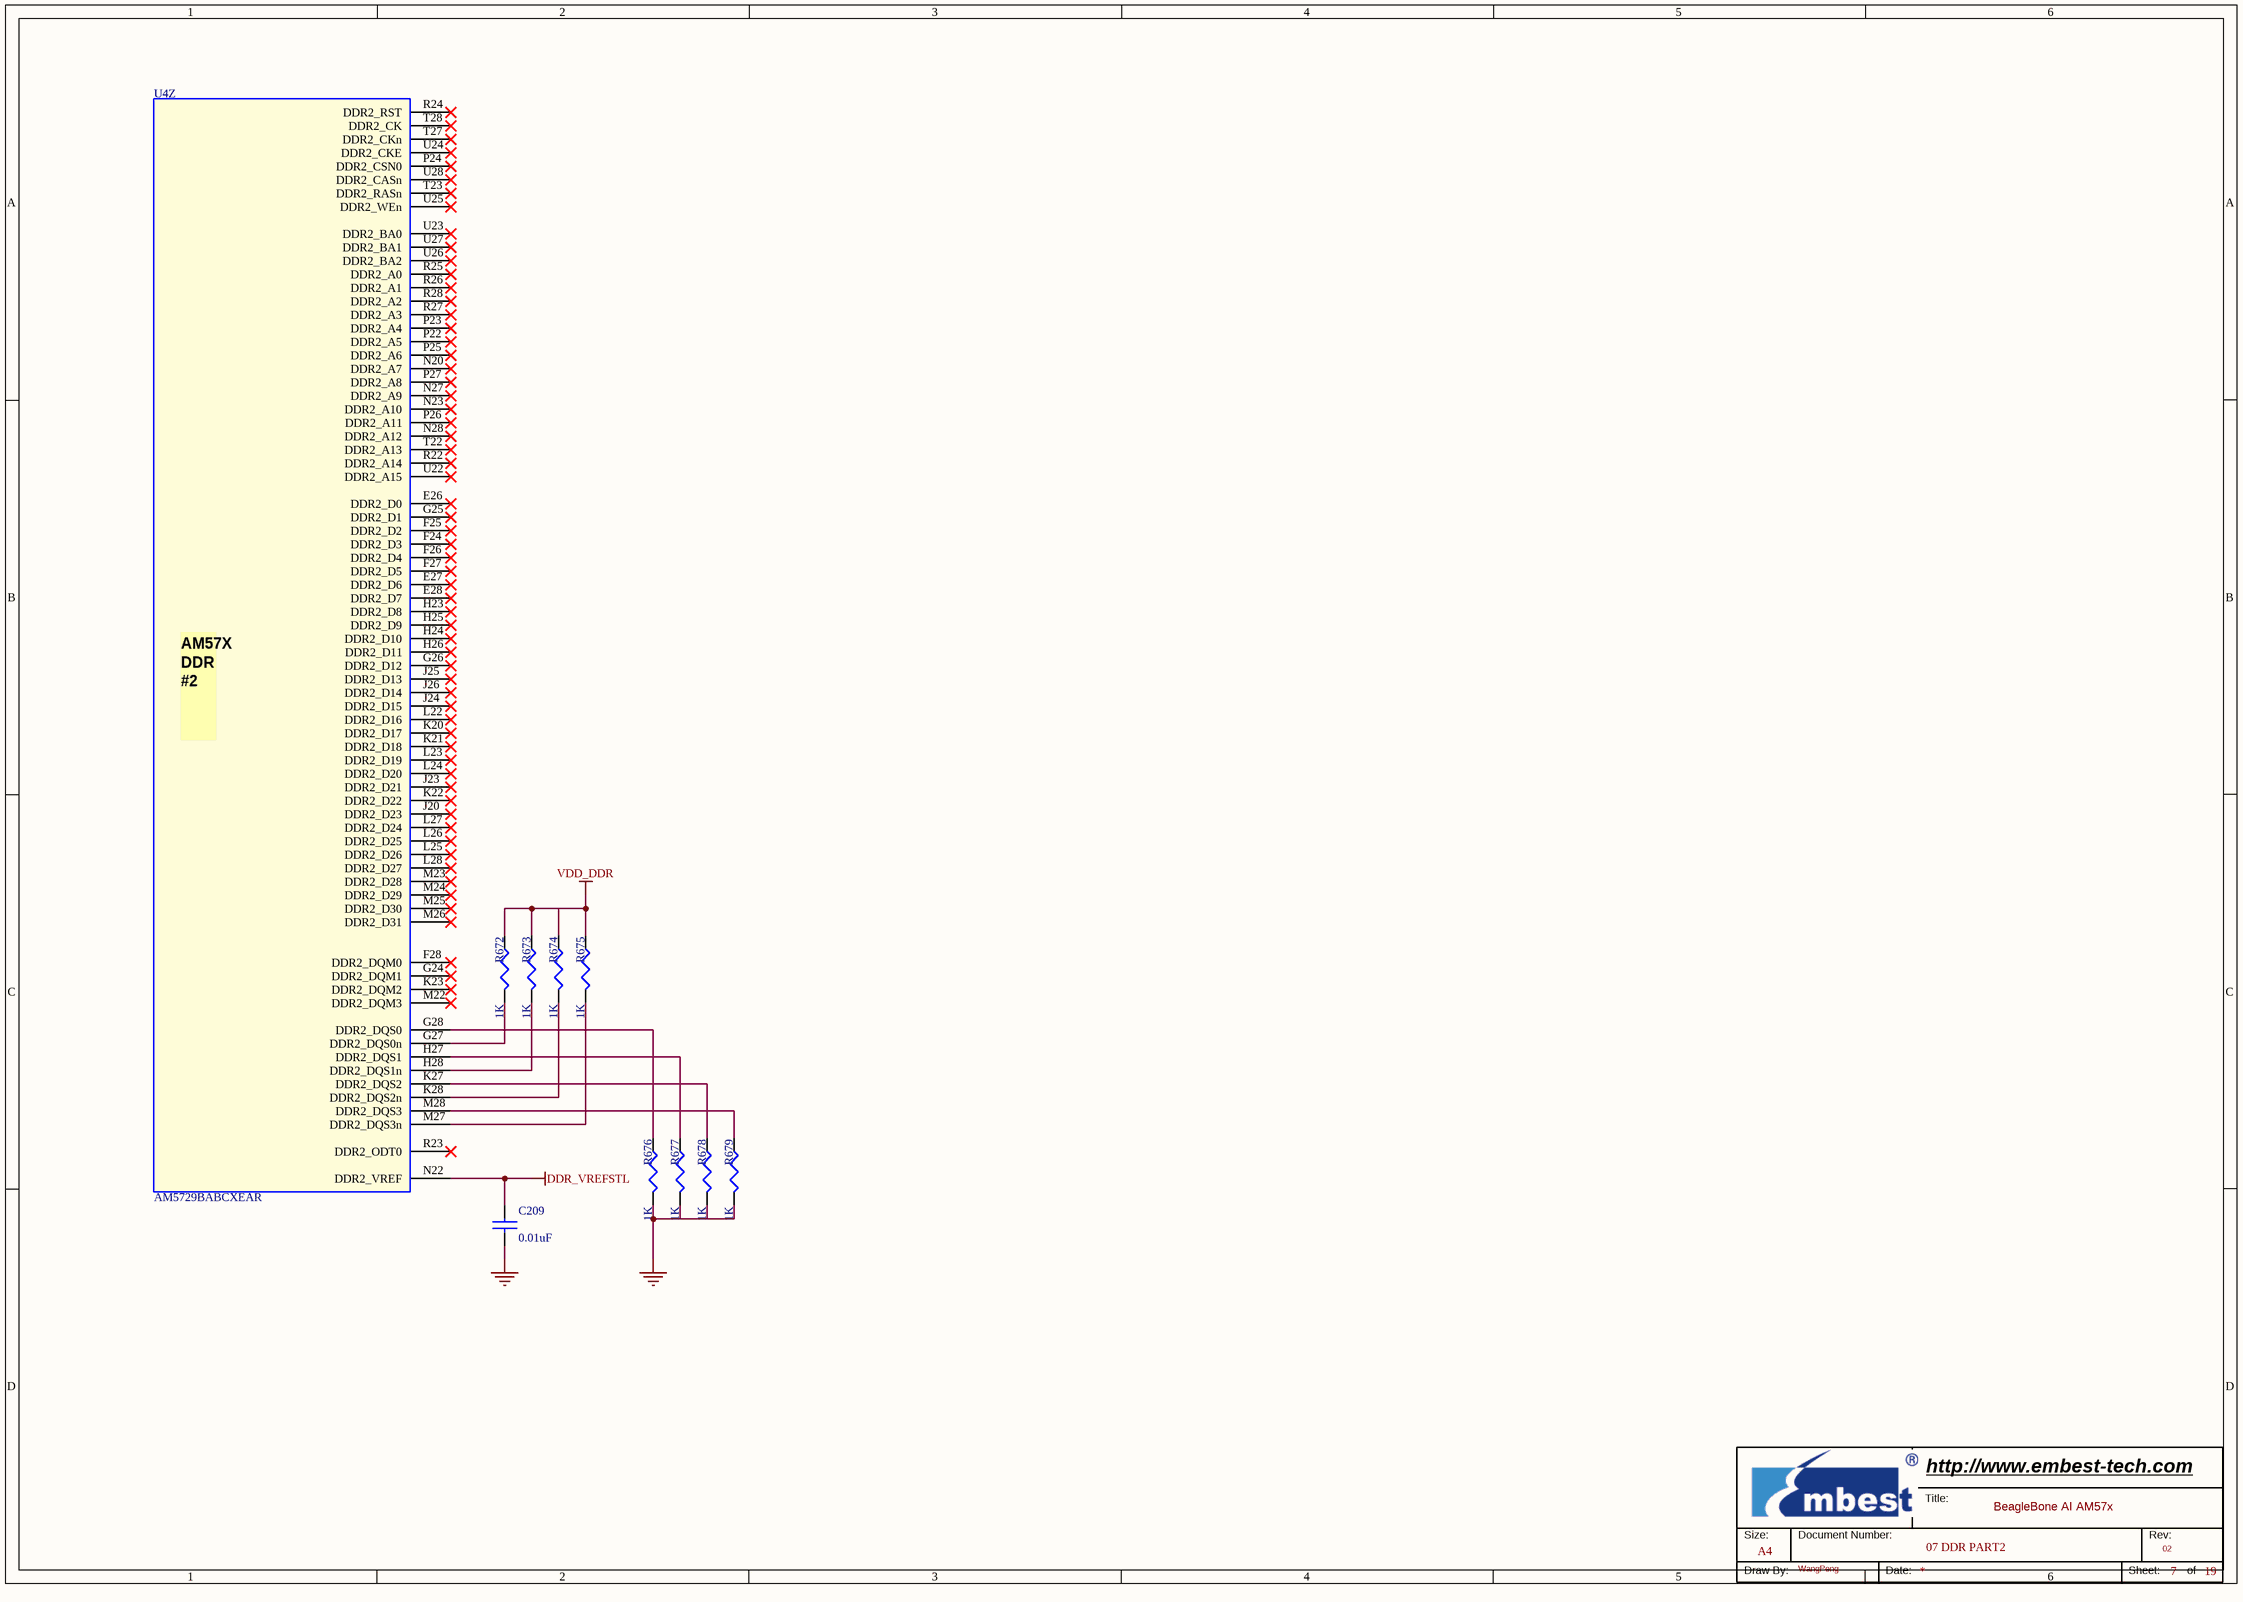
[diagram p5: 07 DDR PART2.SchDoc]

### Parts
(Parts that share a designator on the sheet are numbered #1, #2 ... from top to bottom, then left to right.)
*#5  Page Count: 19  Page Number: 7  Page Size: A4  Title: BeagleBone AI AM57x  RevCode: 02  Doc: 07 DDR PART2  Drawing: WangPeng  (hidden comment: Embest Title)  (graphical)
C209  0.01uF  [C0402]
R672  1K  [R0402]
R673  1K  [R0402]
R674  1K  [R0402]
R675  1K  [R0402]
R676  1K  [R0402]
R677  1K  [R0402]
R678  1K  [R0402]
R679  1K  [R0402]
U4  AM5729BABCXEAR  [BGA23X23-760-117M]  (part Z of 29)

### Nets
DDR_VREFSTL: C209.1 U4.N22(DDR2_VREF)
GND: C209.2 R676.2 R677.2 R678.2 R679.2  [project net DDR1_RST]
VDD_DDR: R672.1 R673.1 R674.1 R675.1
NetR672_2: R672.2 U4.G27(DDR2_DQS0n)
NetR673_2: R673.2 U4.H28(DDR2_DQS1n)
NetR674_2: R674.2 U4.K28(DDR2_DQS2n)
NetR675_2: R675.2 U4.M27(DDR2_DQS3n)
NetR676_1: R676.1 U4.G28(DDR2_DQS0)
NetR677_1: R677.1 U4.H27(DDR2_DQS1)
NetR678_1: R678.1 U4.K27(DDR2_DQS2)
NetR679_1: R679.1 U4.M28(DDR2_DQS3)

Not connected (* = marked no-connect by the designer): U4 E26(DDR2_D0)* E27(DDR2_D6)* E28(DDR2_D7)* F24(DDR2_D3)* F25(DDR2_D2)* F26(DDR2_D4)* F27(DDR2_D5)* F28(DDR2_DQM0)* G24(DDR2_DQM1)* G25(DDR2_D1)* G26(DDR2_D12)* H23(DDR2_D8)* H24(DDR2_D10)* H25(DDR2_D9)* H26(DDR2_D11)* J20(DDR2_D23)* J23(DDR2_D21)* J24(DDR2_D15)* J25(DDR2_D13)* J26(DDR2_D14)* K20(DDR2_D17)* K21(DDR2_D18)* K22(DDR2_D22)* K23(DDR2_DQM2)* L22(DDR2_D16)* L23(DDR2_D19)* L24(DDR2_D20)* L25(DDR2_D26)* L26(DDR2_D25)* L27(DDR2_D24)* L28(DDR2_D27)* M22(DDR2_DQM3)* M23(DDR2_D28)* M24(DDR2_D29)* M25(DDR2_D30)* M26(DDR2_D31)* N20(DDR2_A7)* N23(DDR2_A10)* N27(DDR2_A9)* N28(DDR2_A12)* P22(DDR2_A5)* P23(DDR2_A4)* P24(DDR2_CSN0)* P25(DDR2_A6)* P26(DDR2_A11)* P27(DDR2_A8)* R22(DDR2_A14)* R23(DDR2_ODT0)* R24(DDR2_RST)* R25(DDR2_A0)* R26(DDR2_A1)* R27(DDR2_A3)* R28(DDR2_A2)* T22(DDR2_A13)* T23(DDR2_RASn)* T27(DDR2_CKn)* T28(DDR2_CK)* U22(DDR2_A15)* U23(DDR2_BA0)* U24(DDR2_CKE)* U25(DDR2_WEn)* U26(DDR2_BA2)* U27(DDR2_BA1)* U28(DDR2_CASn)*

### Notes on the sheet
- (in symbol AM57X, part Z) AM57X DDR / #2 /
- (in symbol Embest Title) Title:; Size:; Document Number:; Rev:; Draw By:; Date:; Sheet:; of

### Library data of the parts
C209 = C: as C9 on sheet 06 DDR PART1; Part Type: Ceramic Capacitor
R672 R675 R676 R678 = R: as R150 on sheet 03 PMIC1; Part Type: Thick film Resistor
R673 R674 R677 R679 = R: as R147 on sheet 03 PMIC1; Part Type: Thick film Resistor
U4 = AM57X: as U4 on sheet 05 AM572x SYSTEM; Status: BeagleBone AI; Manufacturer Part Number: AM5729BABCXEAR; Manufacturer: TI; Part Type: MPU
*#5 = Embest Title: Page Create Date: May 29, 2006; WebSite: http://www.embest-tech.com; Company: Embest; Page Modify Date: *